# Altium project RNG_RPI.PrjPcb (part 2 of 3)

## Sheet FPGA_config.SchDoc: RNG RPI Interface
size 420 x 297 mm; Author: G.Kasprowicz; CompanyName: WUT ISE; DrawnBy: G.Kasprowicz; Organization: WUT ISE; Address1: PW ISE; Address2: Nowowiejska 15/19 00-665 Warsaw; Address3: gkasprow@gmail.com; Revision: 2; SheetNumber: -; SheetTotal: -; ModifiedBy: -; CheckedDate: -; Title2: FPGA config & RPI; DivGrp: WUT ISE; Designer: G.Kasprowicz; ModifiedDate: -; ProjectName: Sensor Box
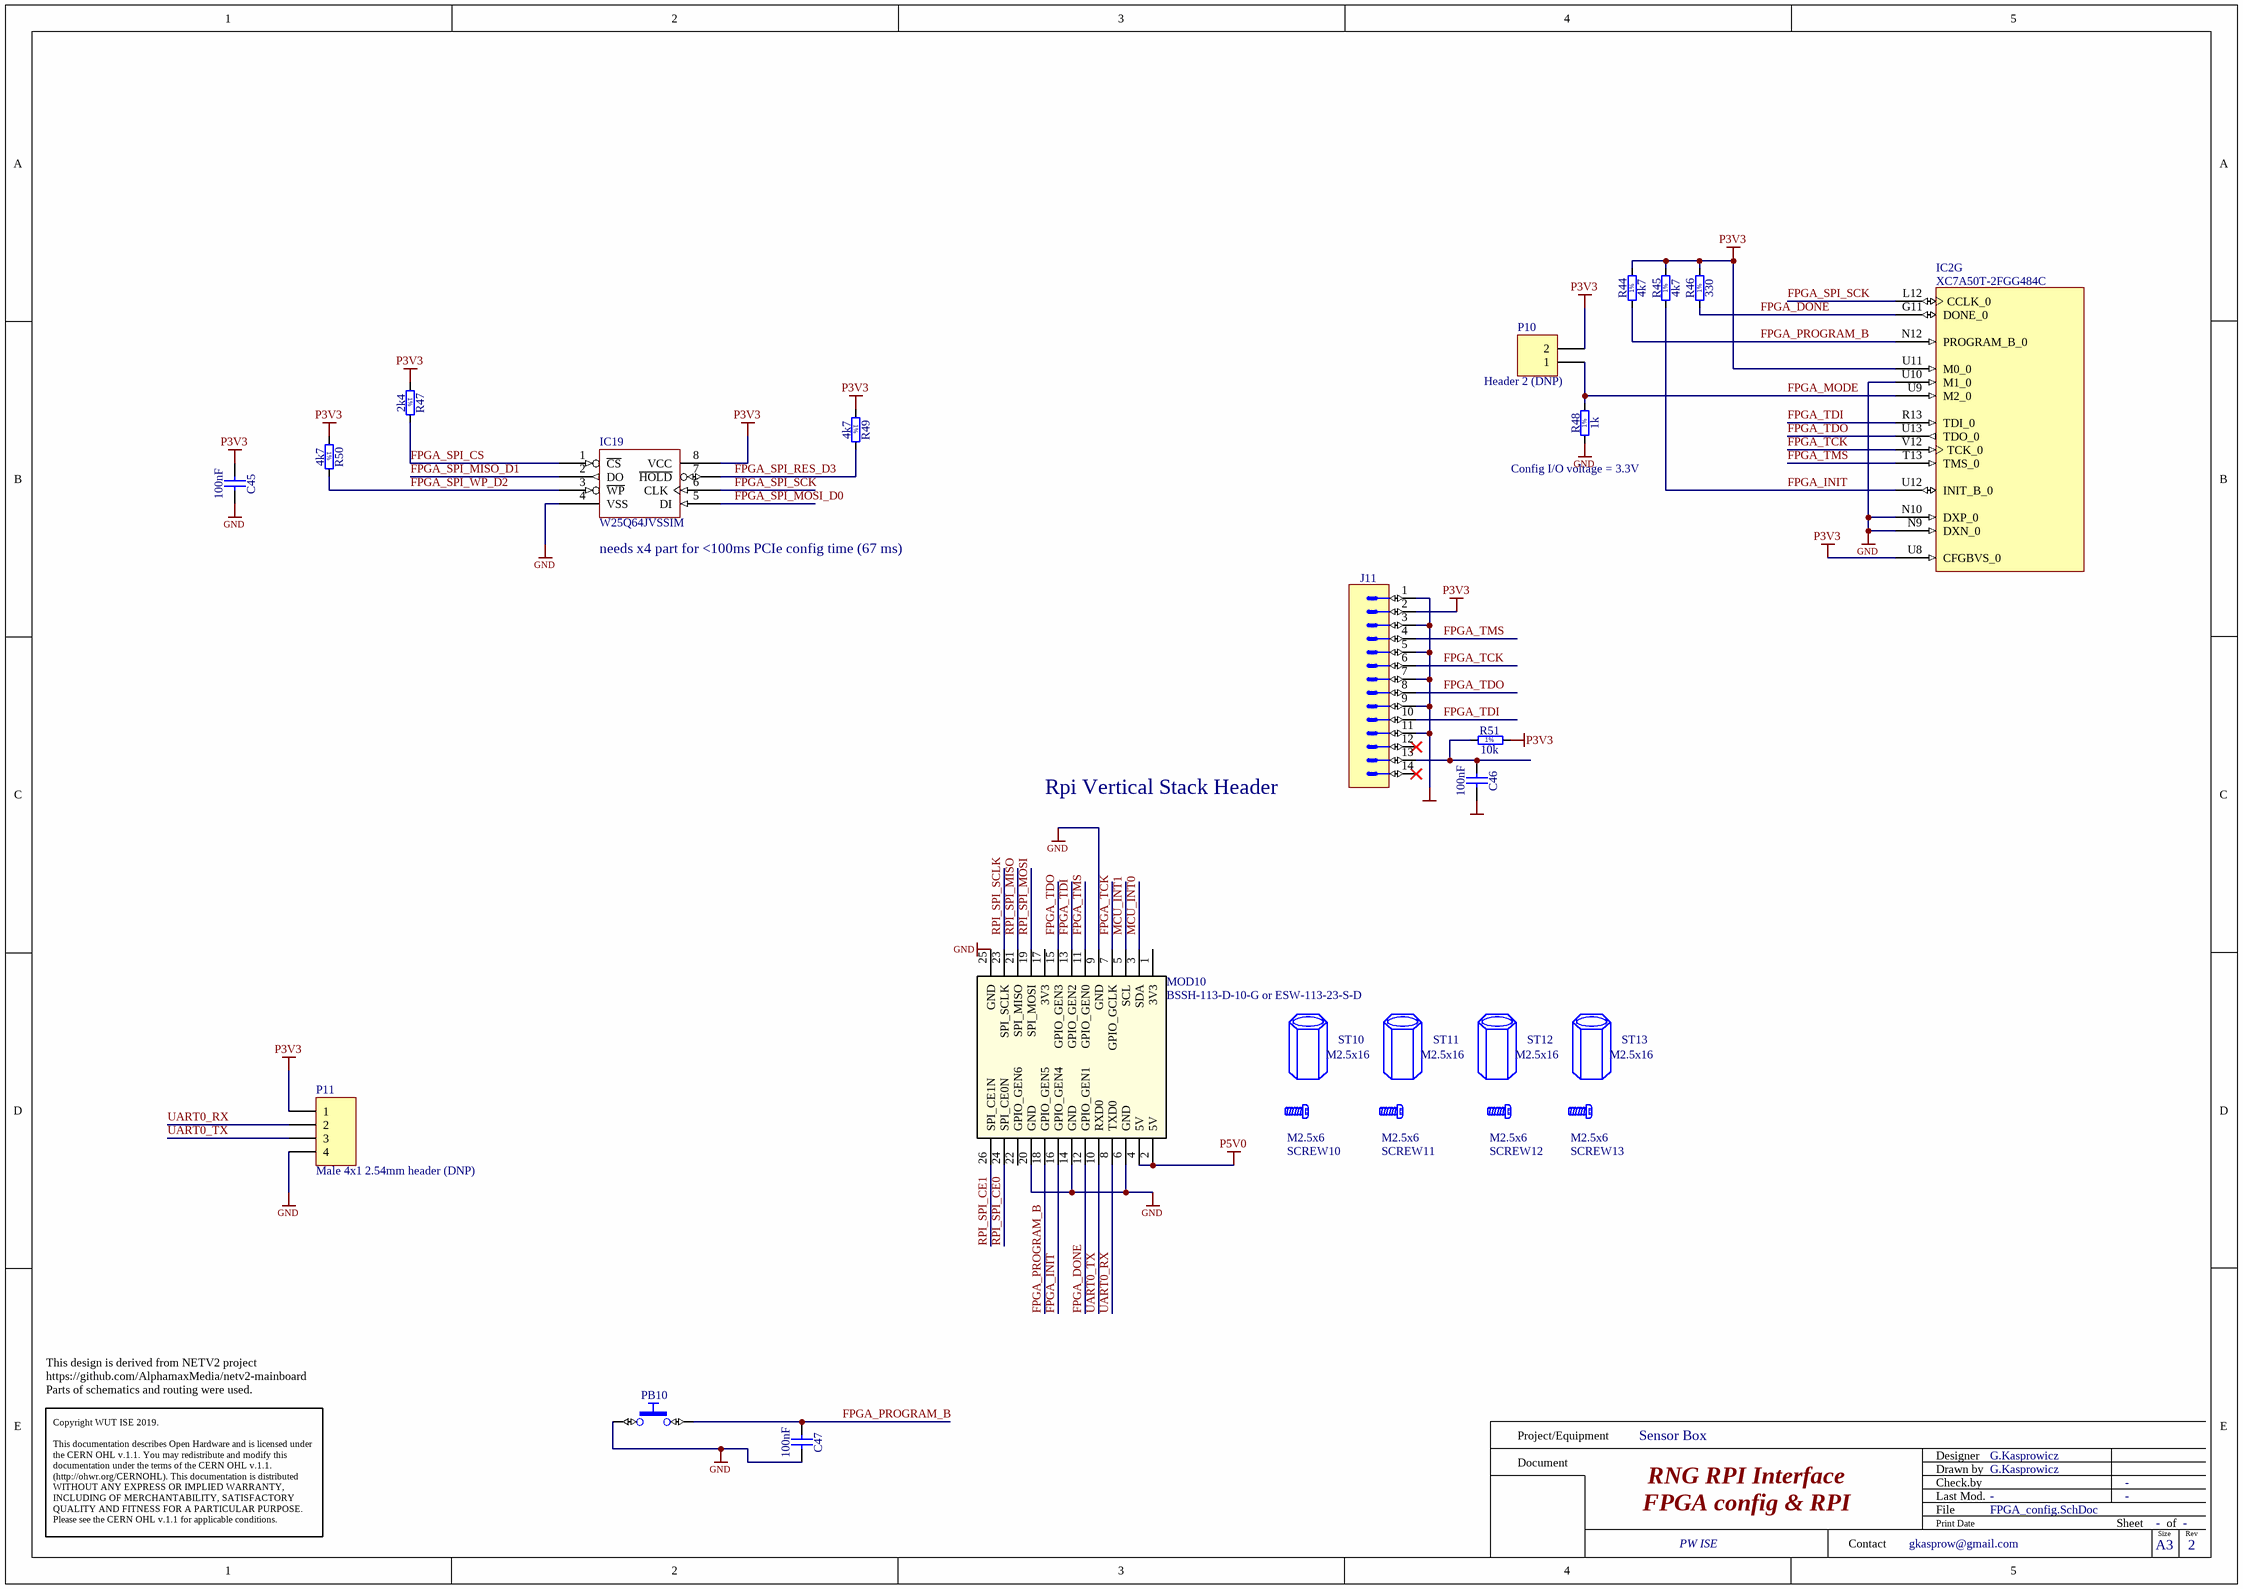
[diagram p1: FPGA_config.SchDoc]

### Parts
C45  100nF  [CAPC0603X33N]
C46  100nF  [CAPC0603X33N]
C47  100nF  [CAPC0603X33N]
IC2  XC7A50T-2FGG484C  [BGA484C100P22X22_2300X2300X260]  (part G of 11)
IC19  W25Q64JVSSIM  [SOIC127P790X216-8N]
J11  Milli-Grid™  [MOLEX_87832-1420]  (value not drawn)
MOD10  BSSH-113-D-10-G or ESW-113-23-S-D  [Raspberr Pi - 26]
P10  Header 2 (DNP)  [HDR1X2]
P11  Male 4x1 2.54mm header (DNP)  [HDR1X4]
PB10  Push Button  [PB_TYCO_FSMSM]  (value not drawn)
R44  4k7  [RESC1005X40N]
R45  4k7  [RESC1005X40N]
R46  330  [RESC1005X40N]
R47  2k4  [RESC1005X40N]
R48  1k  [RESC1005X40N]
R49  4k7  [RESC1005X40N]
R50  4k7  [RESC1005X40N]
R51  10k  [RESC1005X40N]
SCREW10  M2.5x6  [BOSSARD_BN5687-3061597_v]
SCREW11  M2.5x6  [BOSSARD_BN5687-3061597_v]
SCREW12  M2.5x6  [BOSSARD_BN5687-3061597_v]
SCREW13  M2.5x6  [BOSSARD_BN5687-3061597_v]
ST10  M2.5x16  [WURTH_970160155]
ST11  M2.5x16  [WURTH_970160155]
ST12  M2.5x16  [WURTH_970160155]
ST13  M2.5x16  [WURTH_970160155]

### Nets
GND: C45.2 C46.2 C47.2 IC2.N9(DXN_0) IC2.N10(DXP_0) IC2.U10(M1_0) IC19.4(VSS) J11.1 J11.3 J11.5 J11.7 J11.9 J11.11 MOD10.6(GND) MOD10.9(GND) MOD10.14(GND) MOD10.20(GND) MOD10.25(GND) P11.4 PB10.1 R48.1
P3V3: C45.1 IC2.U8(CFGBVS_0) IC2.U11(M0_0) IC19.8(VCC) J11.2 P10.2 P11.1 R44.2 R45.2 R46.2 R47.1 R49.1 R50.1 R51.2
P5V0: MOD10.2(5V) MOD10.4(5V)
FPGA_DONE: IC2.G11(DONE_0) MOD10.12(GPIO_GEN1) R46.1
FPGA_INIT: IC2.U12(INIT_B_0) MOD10.16(GPIO_GEN4) R45.1
FPGA_MODE: IC2.U9(M2_0) P10.1 R48.2
FPGA_PROGRAM_B: C47.1 IC2.N12(PROGRAM_B_0) MOD10.18(GPIO_GEN5) PB10.2 R44.1
FPGA_SPI_CS: IC19.1(~{CS}) R47.2
FPGA_SPI_MISO_D1: IC19.2(DO)
FPGA_SPI_MOSI_D0: IC19.5(DI)
FPGA_SPI_RES_D3: IC19.7(~{HOLD}) R49.2
FPGA_SPI_SCK: IC2.L12(CCLK_0) IC19.6(CLK)
FPGA_SPI_WP_D2: IC19.3(~{WP}) R50.2
FPGA_TCK: IC2.V12(TCK_0) J11.6 MOD10.7(GPIO_GCLK)
FPGA_TDI: IC2.R13(TDI_0) J11.10 MOD10.13(GPIO_GEN2)
FPGA_TDO: IC2.U13(TDO_0) J11.8 MOD10.15(GPIO_GEN3)
FPGA_TMS: IC2.T13(TMS_0) J11.4 MOD10.11(GPIO_GEN0)
MCU_INT0: MOD10.3(SDA)
MCU_INT1: MOD10.5(SCL)
RPI_SPI_CE0: MOD10.24(SPI_CE0N)
RPI_SPI_CE1: MOD10.26(SPI_CE1N)
RPI_SPI_MISO: MOD10.21(SPI_MISO)
RPI_SPI_MOSI: MOD10.19(SPI_MOSI)
RPI_SPI_SCLK: MOD10.23(SPI_SCLK)
UART0_RX: MOD10.8(TXD0) P11.2
UART0_TX: MOD10.10(RXD0) P11.3
NetC46_1: C46.1 J11.13 R51.1

Not connected (* = marked no-connect by the designer): J11 12* 14*; MOD10 1(3V3) 17(3V3) 22(GPIO_GEN6)

### Notes on the sheet
- (near R48) Config I/O voltage = 3.3V
- (near IC19) needs x4 part for <100ms PCIe config time (67 ms)
- Rpi Vertical Stack Header
- This design is derived from NETV2 project
  https://github.com/AlphamaxMedia/netv2-mainboard
  Parts of schematics and routing were used.
- Project/Equipment
- Document
- Designer
- Drawn by
- Check.by
- Copyright WUT ISE 2019.
  This documentation describes Open Hardware and is licensed under the CERN OHL v.1.1. You may redistribute and modify this documentation under the terms of the CERN OHL v.1.1. (http://ohwr.org/CERNOHL). This documentation is distributed WITHOUT ANY EXPRESS OR IMPLIED WARRANTY, INCLUDING OF MERCHANTABILITY, SATISFACTORY QUALITY AND FITNESS FOR A PARTICULAR PURPOSE. Please see the CERN OHL v.1.1 for applicable conditions.
- Contact
- File
- Last Mod.
- Print Date
- Sheet
- Size
- A3
- of
- Rev
- (in symbol R0402_1K_1%_0.0625W_100PPM) 1%
- (in symbol R0402_2K4_1%_0.0625W_100PPM) 1%
- (in symbol R0402_4K7_1%_0.0625W_100PPM) 1%
- (in symbol R0402_10K_1%_0.0625W_100PPM) 1%
- (in symbol R0402_330R_1%_0.0625W_100PPM) 1%

### Library data of the parts
C45-C47 = CC0201_100NF_6.3V_10%_X5R: Non-polarised capacitor; Part Description: SMD Multilayer Chip Ceramic Capacitor; Manufacturer: GENERIC; Manufacturer1 Part Number: 02016D104KAT2A; Voltage: 6.3V; TC: X5R; Tolerance: ±10%; Part Number: CC0201_100NF_6.3V_10%_X5R; Component Kind: Standard; Component Type: Standard; Pin Count: 2; Value: 100nF; Status: Not Recommended; Manufacturer Part Number: CC0201_100NF_6.3V_10%_X5R; Case: 0201; Mounted: Yes; Socket: No; SMD: Yes; Sense: No; Manufacturer1 Example: AVX; Manufacturer1 ComponentHeight: 0.33mm; HelpURL: \\cern.ch\dfs\Applications\Altium\Datasheets\CC0201_X5R_AVX.pdf; Author: CERN DEM JLC; CreateDate: 03.12.2007; LatestRevisionDate: 03.12.2007
IC2 = XC7A50T-2FGG484C: Artix-7 FPGA, 4 GTPs, 250 User I/Os, 484-Ball Fine-Pitch Thin BGA (1.0mm Pitch), Speed Grade 2, Commercial Grade, Pb-Free; Manufacturer: XILINX; PressFit: No; Bonding: No; Part Number: XC7A50T-2FGG484C; Component Kind: Standard; Component Type: Standard; Device: XC7A50T-2FGG484C; PackageDescription: BGA, 1.00mm Pitch, Square; 484 Pin, 22 Columns x 22 Rows, Body 23mm X 23mm X 2.60mm H, IPC Medium Density; Part Description: Artix-7 FPGA, 4 GTPs, 250 User I/Os, 484-Ball Fine-Pitch Thin BGA (1.0mm Pitch), Speed Grade 2, Commercial Grade, Pb-Free; Manufacturer Part Number: XC7A50T-2FGG484C; Pin Count: 484; Case: BGA484; Mounted: Yes; Socket: No; SMD: Yes; Sense: No; ComponentHeight: 2.6mm; HelpURL: \\cern.ch\dfs\Applications\Altium\Datasheets\XC7A50T-2FGG484C.pdf; ComponentLink1URL: \\cern.ch\dfs\Applications\Altium\Datasheets\XC7A50T-2FGG484C_Package-Pinout.pdf; ComponentLink1Description: Package/Pinout; Author: CERN DEM JMW; CreateDate: 26.07.2018; LatestRevisionDate: 26.07.2018
IC19 = EN25P05-50GCP: 64Mbit SPI NOR FLASH; MYPN: UW25Q64JVSSIM; VENDOR: Winbond; MPN: W25Q64JVSSIM
J11 = MOLEX_87832-1420: Connector 14 Male; Part Description: 2.00mm (.079") Pitch Milli-Grid™ Header, Surface Mount, Vertical, Shrouded, 14 Circuits,with Locking Windows and Centre Polarization Slot, PCB Locator; Manufacturer: MOLEX; PressFit: No; Part Number: MOLEX_87832-1420; Component Kind: Standard; Component Type: Standard; Pin Count: 14; Family: Milli-Grid™; Mounted: Yes; Socket: No; SMD: Yes; Sense: No; Status: None; Manufacturer Part Number: 87832-1420; ComponentHeight: 7.6mm; HelpURL: \\cern.ch\dfs\Applications\Altium\Datasheets\MOLEX_87832-1420.pdf; Author: CERN DEM JLC; CreateDate: 09.09.2008; LatestRevisionDate: 09.09.2008
MOD10 = Raspberry Pi - 26: Manufacturer: Major League Electroncis; Datasheet: http://s3.amazonaws.com/mlkelly/productMedia/BSSH-1/BSSH-1-D-Datasheet.pdf; Price1: 1.95; Value: BSSH-113-D-10-G or ESW-113-23-S-D; Supplier 1: https://www.adafruit.com/product/1112; Supplier Part Number 1: BSSH-113-D-10-G or ESW-113-23-S-D; Manufacturer Part Number: BSSH-113-D-10-G or ESW-113-23-S-D
P10 = Header 2: Header, 2-Pin; LatestRevisionDate: 17-Jul-2002; LatestRevisionNote: Re-released for DXP Platform.; Publisher: Altium Limited; VENDOR: DNP; MPN: DNP; MYPN: DNP
P11 = Header 4: Header, 4-Pin; MYPN: J-HDR-2.54-4x1-STD-DNP; LatestRevisionDate: 17-Jul-2002; LatestRevisionNote: Re-released for DXP Platform.; Publisher: Altium Limited; MPN: DNP; VENDOR: DNP
PB10 = PB_TYCO_FSMSM: Push-Button Switch SPDT; Part Description: 12VDC 50mA SPST Tactile  Push-Button Switch; Manufacturer: TYCO ELECTRONICS; Manufacturer Part Number: FSMSM or 1437566-3; PressFit: No; Part Number: PB_TYCO_FSMSM; Component Kind: Standard; Component Type: Standard; Pin Count: 2; PackageDescription: Body 3.5x6.0mm, Pushbutton Switch,  TYCO ALCOSWITCH FSMSM Serie; Family: Push Button; Mounted: Yes; Socket: No; SMD: Yes; Sense: No; Status: None; ComponentHeight: 4.3mm; HelpURL: \\cern.ch\dfs\Applications\Altium\Datasheets\PB_TYCO_FSMSM.pdf; Author: CERN DEM JLC; CreateDate: 30.06.2008; LatestRevisionDate: 21.06.2012
R44 R45 R49 R50 = R0402_4K7_1%_0.0625W_100PPM: Resistor - 1%; Part Description: General Purpose Thick Film Chip Resistor; Manufacturer: GENERIC; Manufacturer1 Part Number: 232270674702L; TC: ±100ppm/°C; PressFit: No; Part Number: R0402_4K7_1%_0.0625W_100PPM; Component Kind: Standard; Component Type: Standard; Pin Count: 2; Value: 4k7; Status: Not Recommended; Power: 0.0625W; Tolerance: ±1%; Manufacturer Part Number: R0402_4K7_1%_0.0625W_100PPM; Case: 0402; Mounted: Yes; Sense: No; Socket: No; SMD: Yes; Manufacturer1 Example: YAGEO PHYCOMP; Manufacturer1 ComponentHeight: 0.4mm; HelpURL: \\cern.ch\dfs\Applications\Altium\Datasheets\R0402_Phycomp_RC0402.pdf; Author: CERN DEM JLC; CreateDate: 03.12.2007; LatestRevisionDate: 17.10.2012
R46 = R0402_330R_1%_0.0625W_100PPM: Resistor - 1%; Part Description: General Purpose Thick Film Chip Resistor; Manufacturer: GENERIC; Manufacturer1 Part Number: 232270673301L; TC: ±100ppm/°C; PressFit: No; Part Number: R0402_330R_1%_0.0625W_100PPM; Component Kind: Standard; Component Type: Standard; Pin Count: 2; Value: 330; Status: Not Recommended; Power: 0.0625W; Tolerance: ±1%; Manufacturer Part Number: R0402_330R_1%_0.0625W_100PPM; Case: 0402; Mounted: Yes; Sense: No; Socket: No; SMD: Yes; Manufacturer1 Example: YAGEO PHYCOMP; Manufacturer1 ComponentHeight: 0.4mm; HelpURL: \\cern.ch\dfs\Applications\Altium\Datasheets\R0402_Phycomp_RC0402.pdf; Author: CERN DEM JLC; CreateDate: 03.12.2007; LatestRevisionDate: 17.10.2012
R47 = R0402_2K4_1%_0.0625W_100PPM: Resistor - 1%; Part Description: General Purpose Thick Film Chip Resistor; Manufacturer: GENERIC; Manufacturer1 Part Number: 232270672402L; TC: ±100ppm/°C; PressFit: No; Part Number: R0402_2K4_1%_0.0625W_100PPM; Component Kind: Standard; Component Type: Standard; Pin Count: 2; Value: 2k4; Status: Not Recommended; Power: 0.0625W; Tolerance: ±1%; Manufacturer Part Number: R0402_2K4_1%_0.0625W_100PPM; Case: 0402; Mounted: Yes; Sense: No; Socket: No; SMD: Yes; Manufacturer1 Example: YAGEO PHYCOMP; Manufacturer1 ComponentHeight: 0.4mm; HelpURL: \\cern.ch\dfs\Applications\Altium\Datasheets\R0402_Phycomp_RC0402.pdf; Author: CERN DEM JLC; CreateDate: 03.12.2007; LatestRevisionDate: 17.10.2012
R48 = R0402_1K_1%_0.0625W_100PPM: Resistor - 1%; Part Description: General Purpose Thick Film Chip Resistor; Manufacturer: GENERIC; Manufacturer1 Part Number: 232270671002L; TC: ±100ppm/°C; PressFit: No; Part Number: R0402_1K_1%_0.0625W_100PPM; Component Kind: Standard; Component Type: Standard; Pin Count: 2; Value: 1k; Status: Not Recommended; Power: 0.0625W; Tolerance: ±1%; Manufacturer Part Number: R0402_1K_1%_0.0625W_100PPM; Case: 0402; Mounted: Yes; Sense: No; Socket: No; SMD: Yes; Manufacturer1 Example: YAGEO PHYCOMP; Manufacturer1 ComponentHeight: 0.4mm; HelpURL: \\cern.ch\dfs\Applications\Altium\Datasheets\R0402_Phycomp_RC0402.pdf; Author: CERN DEM JLC; CreateDate: 03.12.2007; LatestRevisionDate: 17.10.2012
R51 = R0402_10K_1%_0.0625W_100PPM: Resistor - 1%; Part Description: General Purpose Thick Film Chip Resistor; Manufacturer: GENERIC; Manufacturer1 Part Number: 232270671003L; TC: ±100ppm/°C; PressFit: No; Part Number: R0402_10K_1%_0.0625W_100PPM; Component Kind: Standard; Component Type: Standard; Pin Count: 2; Value: 10k; Status: Not Recommended; Power: 0.0625W; Tolerance: ±1%; Manufacturer Part Number: R0402_10K_1%_0.0625W_100PPM; Case: 0402; Mounted: Yes; Sense: No; Socket: No; SMD: Yes; Manufacturer1 Example: YAGEO PHYCOMP; Manufacturer1 ComponentHeight: 0.4mm; HelpURL: \\cern.ch\dfs\Applications\Altium\Datasheets\R0402_Phycomp_RC0402.pdf; Author: CERN DEM JLC; CreateDate: 03.12.2007; LatestRevisionDate: 17.10.2012; ClassName: FPGA_JTAG
SCREW10-SCREW13 = BOSSARD_BN5687-3061597_v: Screw; Part Description: M2.5 L=6mm Hexalobular Socket Pan Head Screw, Fully Threaded, Stainless Steel A2; Manufacturer Part Number: BN5687 Art.3061597; PressFit: No; Part Number: BOSSARD_BN5687-3061597_v; Component Kind: Standard; Component Type: Mechanical; Pin Count: 0; PackageDescription: M2.5 L=6mm Hexalobular Socket Pan Head Screw, Fully Threaded - Stainless Steel A2; Mounted: Yes; Socket: No; SMD: No; Sense: No; Status: None; Value: M2.5x6; Manufacturer: BOSSARD; ComponentHeight: 2.1mm; HelpURL: \\cern.ch\dfs\Applications\Altium\Datasheets\BOSSARD_BN5687-3061597.pdf; Author: CERN DEM JLC; CreateDate: 30.05.2013; LatestRevisionDate: 30.05.2013
ST10-ST13 = MECH_Standoff_M2.5x16: M2.5x16 plastic standoff; Part Description: M2.5x16 female Hex Spacer made of plastic; Manufacturer: WURTH; Manufacturer Part Number: 970160155; PressFit: No; Part Number: WURTH_970160155; Component Kind: Standard; Component Type: Mechanical; Pin Count: 0; PackageDescription: M2.5 L=16mm Hexalobular Socket Pan Head Screw, Fully Threaded - plastic; Mounted: Yes; Socket: No; SMD: No; Sense: No; Status: None; Value: M2.5x16; ComponentHeight: 16mm; HelpURL: \\cern.ch\dfs\Applications\Altium\Datasheets\BOSSARD_BN5687-3061597.pdf; Author: GK; CreateDate: 25.02.2019; LatestRevisionDate: 25.02.2019

## Sheet FPGA.SchDoc: RNG RPI Interface
size 420 x 297 mm; Author: G.Kasprowicz; CompanyName: WUT ISE; DrawnBy: G.Kasprowicz; Organization: WUT ISE; Address1: PW ISE; Address2: Nowowiejska 15/19 00-665 Warsaw; Address3: gkasprow@gmail.com; Revision: 2; SheetNumber: -; SheetTotal: -; ModifiedBy: -; CheckedDate: -; Title2: FPGA banks; DivGrp: WUT ISE; Designer: G.Kasprowicz; ModifiedDate: -; ProjectName: Sensor Box
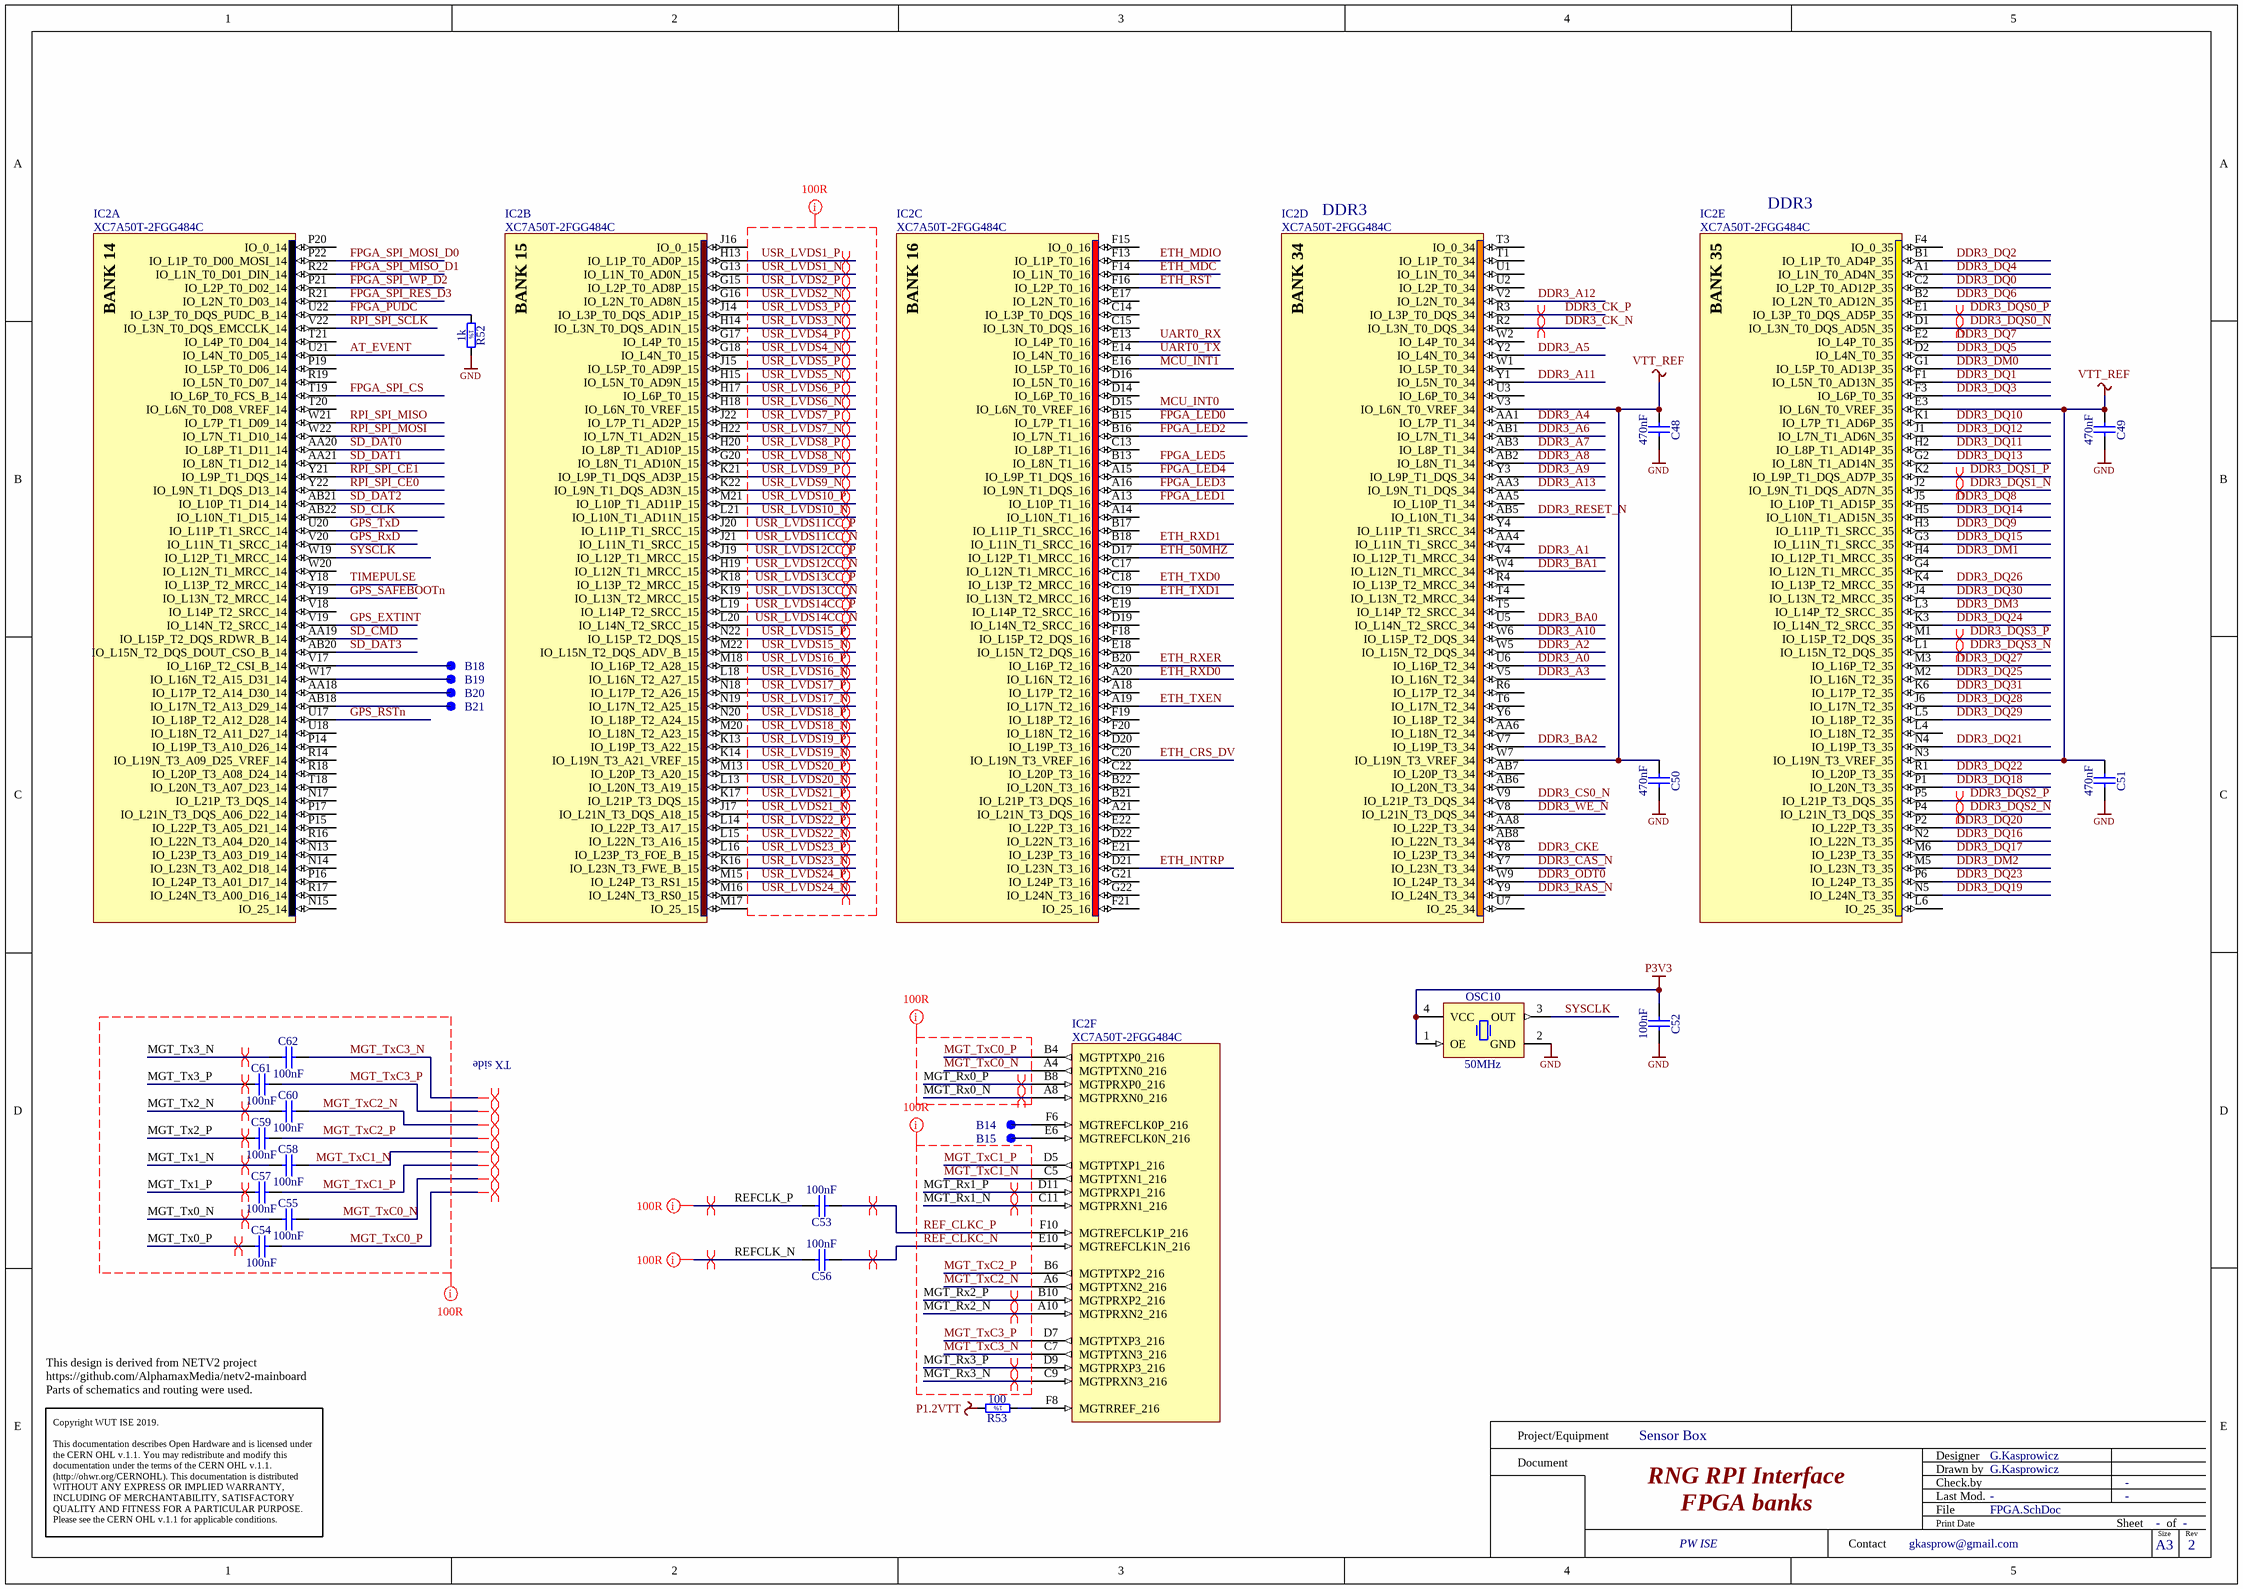
[diagram p2: FPGA.SchDoc]

### Parts
B14  SMD Pad  [C100]  (value not drawn)
B15  SMD Pad  [C100]  (value not drawn)
B18  SMD Pad  [C100]  (value not drawn)
B19  SMD Pad  [C100]  (value not drawn)
B20  SMD Pad  [C100]  (value not drawn)
B21  SMD Pad  [C100]  (value not drawn)
C48  470nF  [CAPC0603X33N]
C49  470nF  [CAPC0603X33N]
C50  470nF  [CAPC0603X33N]
C51  470nF  [CAPC0603X33N]
C52  100nF  [CAPC0603X33N]
C53  100nF  [CAPC0603X33N]
C54  100nF  [CAPC0603X33N]
C55  100nF  [CAPC0603X33N]
C56  100nF  [CAPC0603X33N]
C57  100nF  [CAPC0603X33N]
C58  100nF  [CAPC0603X33N]
C59  100nF  [CAPC0603X33N]
C60  100nF  [CAPC0603X33N]
C61  100nF  [CAPC0603X33N]
C62  100nF  [CAPC0603X33N]
IC2  XC7A50T-2FGG484C  [BGA484C100P22X22_2300X2300X260]  (parts A,B,C,D,E,F of 11)
OSC10  50MHz  [OSCSC254P320X500X130-4N]
R52  1k  [RESC1005X40N]
R53  100  [RESC1005X40N]

### Nets
GND: C48.2 C49.2 C50.2 C51.2 C52.2 OSC10.2(GND) R52.2
P1.2VTT: R53.2
P3V3: C52.1 OSC10.1(OE) OSC10.4(VCC)
VTT_REF: C48.1 C49.1 C50.1 C51.1 IC2.E3(IO_L6N_T0_VREF_35) IC2.N3(IO_L19N_T3_VREF_35) IC2.V3(IO_L6N_T0_VREF_34) IC2.W7(IO_L19N_T3_VREF_34)
AT_EVENT: IC2.U21(IO_L4N_T0_D05_14)
DDR3_A0: IC2.U6(IO_L16P_T2_34)
DDR3_A1: IC2.V4(IO_L12P_T1_MRCC_34)
DDR3_A2: IC2.W5(IO_L15N_T2_DQS_34)
DDR3_A3: IC2.V5(IO_L16N_T2_34)
DDR3_A4: IC2.AA1(IO_L7P_T1_34)
DDR3_A5: IC2.Y2(IO_L4N_T0_34)
DDR3_A6: IC2.AB1(IO_L7N_T1_34)
DDR3_A7: IC2.AB3(IO_L8P_T1_34)
DDR3_A8: IC2.AB2(IO_L8N_T1_34)
DDR3_A9: IC2.Y3(IO_L9P_T1_DQS_34)
DDR3_A10: IC2.W6(IO_L15P_T2_DQS_34)
DDR3_A11: IC2.Y1(IO_L5N_T0_34)
DDR3_A12: IC2.V2(IO_L2N_T0_34)
DDR3_A13: IC2.AA3(IO_L9N_T1_DQS_34)
DDR3_BA0: IC2.U5(IO_L14N_T2_SRCC_34)
DDR3_BA1: IC2.W4(IO_L12N_T1_MRCC_34)
DDR3_BA2: IC2.V7(IO_L19P_T3_34)
DDR3_CAS_N: IC2.Y7(IO_L23N_T3_34)
DDR3_CK_N: IC2.R2(IO_L3N_T0_DQS_34)
DDR3_CK_P: IC2.R3(IO_L3P_T0_DQS_34)
DDR3_CKE: IC2.Y8(IO_L23P_T3_34)
DDR3_CS0_N: IC2.V9(IO_L21P_T3_DQS_34)
DDR3_DM0: IC2.G1(IO_L5P_T0_AD13P_35)
DDR3_DM1: IC2.H4(IO_L12P_T1_MRCC_35)
DDR3_DM2: IC2.M5(IO_L23N_T3_35)
DDR3_DM3: IC2.L3(IO_L14P_T2_SRCC_35)
DDR3_DQ0: IC2.C2(IO_L2P_T0_AD12P_35)
DDR3_DQ1: IC2.F1(IO_L5N_T0_AD13N_35)
DDR3_DQ2: IC2.B1(IO_L1P_T0_AD4P_35)
DDR3_DQ3: IC2.F3(IO_L6P_T0_35)
DDR3_DQ4: IC2.A1(IO_L1N_T0_AD4N_35)
DDR3_DQ5: IC2.D2(IO_L4N_T0_35)
DDR3_DQ6: IC2.B2(IO_L2N_T0_AD12N_35)
DDR3_DQ7: IC2.E2(IO_L4P_T0_35)
DDR3_DQ8: IC2.J5(IO_L10P_T1_AD15P_35)
DDR3_DQ9: IC2.H3(IO_L11P_T1_SRCC_35)
DDR3_DQ10: IC2.K1(IO_L7P_T1_AD6P_35)
DDR3_DQ11: IC2.H2(IO_L8P_T1_AD14P_35)
DDR3_DQ12: IC2.J1(IO_L7N_T1_AD6N_35)
DDR3_DQ13: IC2.G2(IO_L8N_T1_AD14N_35)
DDR3_DQ14: IC2.H5(IO_L10N_T1_AD15N_35)
DDR3_DQ15: IC2.G3(IO_L11N_T1_SRCC_35)
DDR3_DQ16: IC2.N2(IO_L22N_T3_35)
DDR3_DQ17: IC2.M6(IO_L23P_T3_35)
DDR3_DQ18: IC2.P1(IO_L20N_T3_35)
DDR3_DQ19: IC2.N5(IO_L24N_T3_35)
DDR3_DQ20: IC2.P2(IO_L22P_T3_35)
DDR3_DQ21: IC2.N4(IO_L19P_T3_35)
DDR3_DQ22: IC2.R1(IO_L20P_T3_35)
DDR3_DQ23: IC2.P6(IO_L24P_T3_35)
DDR3_DQ24: IC2.K3(IO_L14N_T2_SRCC_35)
DDR3_DQ25: IC2.M2(IO_L16N_T2_35)
DDR3_DQ26: IC2.K4(IO_L13P_T2_MRCC_35)
DDR3_DQ27: IC2.M3(IO_L16P_T2_35)
DDR3_DQ28: IC2.J6(IO_L17N_T2_35)
DDR3_DQ29: IC2.L5(IO_L18P_T2_35)
DDR3_DQ30: IC2.J4(IO_L13N_T2_MRCC_35)
DDR3_DQ31: IC2.K6(IO_L17P_T2_35)
DDR3_DQS0_N: IC2.D1(IO_L3N_T0_DQS_AD5N_35)
DDR3_DQS0_P: IC2.E1(IO_L3P_T0_DQS_AD5P_35)
DDR3_DQS1_N: IC2.J2(IO_L9N_T1_DQS_AD7N_35)
DDR3_DQS1_P: IC2.K2(IO_L9P_T1_DQS_AD7P_35)
DDR3_DQS2_N: IC2.P4(IO_L21N_T3_DQS_35)
DDR3_DQS2_P: IC2.P5(IO_L21P_T3_DQS_35)
DDR3_DQS3_N: IC2.L1(IO_L15N_T2_DQS_35)
DDR3_DQS3_P: IC2.M1(IO_L15P_T2_DQS_35)
DDR3_ODT0: IC2.W9(IO_L24P_T3_34)
DDR3_RAS_N: IC2.Y9(IO_L24N_T3_34)
DDR3_RESET_N: IC2.AB5(IO_L10N_T1_34)
DDR3_WE_N: IC2.V8(IO_L21N_T3_DQS_34)
ETH_50MHZ: IC2.D17(IO_L12P_T1_MRCC_16)
ETH_CRS_DV: IC2.C20(IO_L19N_T3_VREF_16)
ETH_INTRP: IC2.D21(IO_L23N_T3_16)
ETH_MDC: IC2.F14(IO_L1N_T0_16)
ETH_MDIO: IC2.F13(IO_L1P_T0_16)
ETH_RST: IC2.F16(IO_L2P_T0_16)
ETH_RXD0: IC2.A20(IO_L16N_T2_16)
ETH_RXD1: IC2.B18(IO_L11N_T1_SRCC_16)
ETH_RXER: IC2.B20(IO_L16P_T2_16)
ETH_TXD0: IC2.C18(IO_L13P_T2_MRCC_16)
ETH_TXD1: IC2.C19(IO_L13N_T2_MRCC_16)
ETH_TXEN: IC2.A19(IO_L17N_T2_16)
FPGA_LED0: IC2.B15(IO_L7P_T1_16)
FPGA_LED1: IC2.A13(IO_L10P_T1_16)
FPGA_LED2: IC2.B16(IO_L7N_T1_16)
FPGA_LED3: IC2.A16(IO_L9N_T1_DQS_16)
FPGA_LED4: IC2.A15(IO_L9P_T1_DQS_16)
FPGA_LED5: IC2.B13(IO_L8N_T1_16)
FPGA_PUDC: IC2.U22(IO_L3P_T0_DQS_PUDC_B_14) R52.1
FPGA_SPI_CS: IC2.T19(IO_L6P_T0_FCS_B_14)
FPGA_SPI_MISO_D1: IC2.R22(IO_L1N_T0_D01_DIN_14)
FPGA_SPI_MOSI_D0: IC2.P22(IO_L1P_T0_D00_MOSI_14)
FPGA_SPI_RES_D3: IC2.R21(IO_L2N_T0_D03_14)
FPGA_SPI_WP_D2: IC2.P21(IO_L2P_T0_D02_14)
GPS_EXTINT: IC2.V19(IO_L14N_T2_SRCC_14)
GPS_RSTn: IC2.U17(IO_L18P_T2_A12_D28_14)
GPS_RxD: IC2.V20(IO_L11N_T1_SRCC_14)
GPS_SAFEBOOTn: IC2.Y19(IO_L13N_T2_MRCC_14)
GPS_TxD: IC2.U20(IO_L11P_T1_SRCC_14)
MCU_INT0: IC2.D15(IO_L6N_T0_VREF_16)
MCU_INT1: IC2.E16(IO_L5P_T0_16)
MGT_Rx0_N: IC2.A8(MGTPRXN0_216)
MGT_Rx0_P: IC2.B8(MGTPRXP0_216)
MGT_Rx1_N: IC2.C11(MGTPRXN1_216)
MGT_Rx1_P: IC2.D11(MGTPRXP1_216)
MGT_Rx2_N: IC2.A10(MGTPRXN2_216)
MGT_Rx2_P: IC2.B10(MGTPRXP2_216)
MGT_Rx3_N: IC2.C9(MGTPRXN3_216)
MGT_Rx3_P: IC2.D9(MGTPRXP3_216)
MGT_Tx0_N: C55.1
MGT_Tx0_P: C54.1
MGT_Tx1_N: C58.1
MGT_Tx1_P: C57.1
MGT_Tx2_N: C60.1
MGT_Tx2_P: C59.1
MGT_Tx3_N: C62.1
MGT_Tx3_P: C61.1
MGT_TxC0_N: C55.2 IC2.A4(MGTPTXN0_216)
MGT_TxC0_P: C54.2 IC2.B4(MGTPTXP0_216)
MGT_TxC1_N: C58.2 IC2.C5(MGTPTXN1_216)
MGT_TxC1_P: C57.2 IC2.D5(MGTPTXP1_216)
MGT_TxC2_N: C60.2 IC2.A6(MGTPTXN2_216)
MGT_TxC2_P: C59.2 IC2.B6(MGTPTXP2_216)
MGT_TxC3_N: C62.2 IC2.C7(MGTPTXN3_216)
MGT_TxC3_P: C61.2 IC2.D7(MGTPTXP3_216)
REF_CLKC_N: C56.1 IC2.E10(MGTREFCLK1N_216)
REF_CLKC_P: C53.1 IC2.F10(MGTREFCLK1P_216)
REFCLK_N: C56.2
REFCLK_P: C53.2
RPI_SPI_CE0: IC2.Y22(IO_L9N_T1_DQS_D13_14)
RPI_SPI_CE1: IC2.Y21(IO_L9P_T1_DQS_14)
RPI_SPI_MISO: IC2.W21(IO_L7P_T1_D09_14)
RPI_SPI_MOSI: IC2.W22(IO_L7N_T1_D10_14)
RPI_SPI_SCLK: IC2.V22(IO_L3N_T0_DQS_EMCCLK_14)
SD_CLK: IC2.AB22(IO_L10N_T1_D15_14)
SD_CMD: IC2.AA19(IO_L15P_T2_DQS_RDWR_B_14)
SD_DAT0: IC2.AA20(IO_L8P_T1_D11_14)
SD_DAT1: IC2.AA21(IO_L8N_T1_D12_14)
SD_DAT2: IC2.AB21(IO_L10P_T1_D14_14)
SD_DAT3: IC2.AB20(IO_L15N_T2_DQS_DOUT_CSO_B_14)
SYSCLK: IC2.W19(IO_L12P_T1_MRCC_14) OSC10.3(OUT)
TIMEPULSE: IC2.Y18(IO_L13P_T2_MRCC_14)
UART0_RX: IC2.E13(IO_L4P_T0_16)
UART0_TX: IC2.E14(IO_L4N_T0_16)
USR_LVDS1_N: IC2.G13(IO_L1N_T0_AD0N_15)
USR_LVDS1_P: IC2.H13(IO_L1P_T0_AD0P_15)
USR_LVDS2_N: IC2.G16(IO_L2N_T0_AD8N_15)
USR_LVDS2_P: IC2.G15(IO_L2P_T0_AD8P_15)
USR_LVDS3_N: IC2.H14(IO_L3N_T0_DQS_AD1N_15)
USR_LVDS3_P: IC2.J14(IO_L3P_T0_DQS_AD1P_15)
USR_LVDS4_N: IC2.G18(IO_L4N_T0_15)
USR_LVDS4_P: IC2.G17(IO_L4P_T0_15)
USR_LVDS5_N: IC2.H15(IO_L5N_T0_AD9N_15)
USR_LVDS5_P: IC2.J15(IO_L5P_T0_AD9P_15)
USR_LVDS6_N: IC2.H18(IO_L6N_T0_VREF_15)
USR_LVDS6_P: IC2.H17(IO_L6P_T0_15)
USR_LVDS7_N: IC2.H22(IO_L7N_T1_AD2N_15)
USR_LVDS7_P: IC2.J22(IO_L7P_T1_AD2P_15)
USR_LVDS8_N: IC2.G20(IO_L8N_T1_AD10N_15)
USR_LVDS8_P: IC2.H20(IO_L8P_T1_AD10P_15)
USR_LVDS9_N: IC2.K22(IO_L9N_T1_DQS_AD3N_15)
USR_LVDS9_P: IC2.K21(IO_L9P_T1_DQS_AD3P_15)
USR_LVDS10_N: IC2.L21(IO_L10N_T1_AD11N_15)
USR_LVDS10_P: IC2.M21(IO_L10P_T1_AD11P_15)
USR_LVDS11CC_N: IC2.J21(IO_L11N_T1_SRCC_15)
USR_LVDS11CC_P: IC2.J20(IO_L11P_T1_SRCC_15)
USR_LVDS12CC_N: IC2.H19(IO_L12N_T1_MRCC_15)
USR_LVDS12CC_P: IC2.J19(IO_L12P_T1_MRCC_15)
USR_LVDS13CC_N: IC2.K19(IO_L13N_T2_MRCC_15)
USR_LVDS13CC_P: IC2.K18(IO_L13P_T2_MRCC_15)
USR_LVDS14CC_N: IC2.L20(IO_L14N_T2_SRCC_15)
USR_LVDS14CC_P: IC2.L19(IO_L14P_T2_SRCC_15)
USR_LVDS15_N: IC2.M22(IO_L15N_T2_DQS_ADV_B_15)
USR_LVDS15_P: IC2.N22(IO_L15P_T2_DQS_15)
USR_LVDS16_N: IC2.L18(IO_L16N_T2_A27_15)
USR_LVDS16_P: IC2.M18(IO_L16P_T2_A28_15)
USR_LVDS17_N: IC2.N19(IO_L17N_T2_A25_15)
USR_LVDS17_P: IC2.N18(IO_L17P_T2_A26_15)
USR_LVDS18_N: IC2.M20(IO_L18N_T2_A23_15)
USR_LVDS18_P: IC2.N20(IO_L18P_T2_A24_15)
USR_LVDS19_N: IC2.K14(IO_L19N_T3_A21_VREF_15)
USR_LVDS19_P: IC2.K13(IO_L19P_T3_A22_15)
USR_LVDS20_N: IC2.L13(IO_L20N_T3_A19_15)
USR_LVDS20_P: IC2.M13(IO_L20P_T3_A20_15)
USR_LVDS21_N: IC2.J17(IO_L21N_T3_DQS_A18_15)
USR_LVDS21_P: IC2.K17(IO_L21P_T3_DQS_15)
USR_LVDS22_N: IC2.L15(IO_L22N_T3_A16_15)
USR_LVDS22_P: IC2.L14(IO_L22P_T3_A17_15)
USR_LVDS23_N: IC2.K16(IO_L23N_T3_FWE_B_15)
USR_LVDS23_P: IC2.L16(IO_L23P_T3_FOE_B_15)
USR_LVDS24_N: IC2.M16(IO_L24N_T3_RS0_15)
USR_LVDS24_P: IC2.M15(IO_L24P_T3_RS1_15)
NetB14_1: B14.1 IC2.F6(MGTREFCLK0P_216)
NetB15_1: B15.1 IC2.E6(MGTREFCLK0N_216)
NetB18_1: B18.1 IC2.V17(IO_L16P_T2_CSI_B_14)
NetB19_1: B19.1 IC2.W17(IO_L16N_T2_A15_D31_14)
NetB20_1: B20.1 IC2.AA18(IO_L17P_T2_A14_D30_14)
NetB21_1: B21.1 IC2.AB18(IO_L17N_T2_A13_D29_14)
NetIC2_F8: IC2.F8(MGTRREF_216) R53.1

Not connected (* = marked no-connect by the designer): IC2 A14(IO_L10N_T1_16) A18(IO_L17P_T2_16) A21(IO_L21N_T3_DQS_16) AA4(IO_L11N_T1_SRCC_34) AA5(IO_L10P_T1_34) AA6(IO_L18N_T2_34) AA8(IO_L22P_T3_34) AB6(IO_L20N_T3_34) AB7(IO_L20P_T3_34) AB8(IO_L22N_T3_34) B17(IO_L11P_T1_SRCC_16) B21(IO_L21P_T3_DQS_16) B22(IO_L20N_T3_16) C13(IO_L8P_T1_16) C14(IO_L3P_T0_DQS_16) C15(IO_L3N_T0_DQS_16) C17(IO_L12N_T1_MRCC_16) C22(IO_L20P_T3_16) D14(IO_L6P_T0_16) D16(IO_L5N_T0_16) D19(IO_L14N_T2_SRCC_16) D20(IO_L19P_T3_16) D22(IO_L22N_T3_16) E17(IO_L2N_T0_16) E18(IO_L15N_T2_DQS_16) E19(IO_L14P_T2_SRCC_16) E21(IO_L23P_T3_16) E22(IO_L22P_T3_16) F4(IO_0_35) F15(IO_0_16) F18(IO_L15P_T2_DQS_16) F19(IO_L18P_T2_16) F20(IO_L18N_T2_16) F21(IO_25_16) G4(IO_L12N_T1_MRCC_35) G21(IO_L24P_T3_16) G22(IO_L24N_T3_16) J16(IO_0_15) L4(IO_L18N_T2_35) L6(IO_25_35) M17(IO_25_15) N13(IO_L23P_T3_A03_D19_14) N14(IO_L23N_T3_A02_D18_14) N15(IO_25_14) N17(IO_L21P_T3_DQS_14) P14(IO_L19P_T3_A10_D26_14) P15(IO_L22P_T3_A05_D21_14) P16(IO_L24P_T3_A01_D17_14) P17(IO_L21N_T3_DQS_A06_D22_14) P19(IO_L5P_T0_D06_14) P20(IO_0_14) R4(IO_L13P_T2_MRCC_34) R6(IO_L17P_T2_34) R14(IO_L19N_T3_A09_D25_VREF_14) R16(IO_L22N_T3_A04_D20_14) R17(IO_L24N_T3_A00_D16_14) R18(IO_L20P_T3_A08_D24_14) R19(IO_L5N_T0_D07_14) T1(IO_L1P_T0_34) T3(IO_0_34) T4(IO_L13N_T2_MRCC_34) T5(IO_L14P_T2_SRCC_34) T6(IO_L17N_T2_34) T18(IO_L20N_T3_A07_D23_14) T20(IO_L6N_T0_D08_VREF_14) T21(IO_L4P_T0_D04_14) U1(IO_L1N_T0_34) U2(IO_L2P_T0_34) U3(IO_L6P_T0_34) U7(IO_25_34) U18(IO_L18N_T2_A11_D27_14) V18(IO_L14P_T2_SRCC_14) W1(IO_L5P_T0_34) W2(IO_L4P_T0_34) W20(IO_L12N_T1_MRCC_14) Y4(IO_L11P_T1_SRCC_34) Y6(IO_L18P_T2_34)

### Layout directives
differential pair: DDR3_CK_N, DDR3_CK_P, DDR3_DQS0_N, DDR3_DQS0_P, DDR3_DQS1_N, DDR3_DQS1_P, DDR3_DQS2_N, DDR3_DQS2_P, DDR3_DQS3_N, DDR3_DQS3_P, MGT_Rx0_N, MGT_Rx0_P, MGT_Rx1_N, MGT_Rx1_P, MGT_Rx2_N, MGT_Rx2_P, MGT_Rx3_N, MGT_Rx3_P, MGT_Tx0_N, MGT_Tx0_P, MGT_Tx1_N, MGT_Tx1_P, MGT_Tx2_N, MGT_Tx2_P, MGT_Tx3_N, MGT_Tx3_P, MGT_TxC0_N, MGT_TxC0_P, MGT_TxC1_N, MGT_TxC1_P, MGT_TxC2_N, MGT_TxC2_P, MGT_TxC3_N, MGT_TxC3_P, REF_CLKC_N, REF_CLKC_P, REFCLK_N, REFCLK_P, USR_LVDS1_N, USR_LVDS1_P, USR_LVDS2_N, USR_LVDS2_P, USR_LVDS3_N, USR_LVDS3_P, USR_LVDS4_N, USR_LVDS4_P, USR_LVDS5_N, USR_LVDS5_P, USR_LVDS6_N, USR_LVDS6_P, USR_LVDS7_N, USR_LVDS7_P, USR_LVDS8_N, USR_LVDS8_P, USR_LVDS9_N, USR_LVDS9_P, USR_LVDS10_N, USR_LVDS10_P, USR_LVDS11CC_N, USR_LVDS11CC_P, USR_LVDS12CC_N, USR_LVDS12CC_P, USR_LVDS13CC_N, USR_LVDS13CC_P, USR_LVDS14CC_N, USR_LVDS14CC_P, USR_LVDS15_N, USR_LVDS15_P, USR_LVDS16_N, USR_LVDS16_P, USR_LVDS17_N, USR_LVDS17_P, USR_LVDS18_N, USR_LVDS18_P, USR_LVDS19_N, USR_LVDS19_P, USR_LVDS20_N, USR_LVDS20_P, USR_LVDS21_N, USR_LVDS21_P, USR_LVDS22_N, USR_LVDS22_P, USR_LVDS23_N, USR_LVDS23_P, USR_LVDS24_N, USR_LVDS24_P
net class Z100R: MGT_Rx0_N, MGT_Rx0_P, MGT_Rx1_N, MGT_Rx1_P, MGT_Rx2_N, MGT_Rx2_P, MGT_Rx3_N, MGT_Rx3_P, MGT_Tx0_N, MGT_Tx0_P, MGT_Tx1_N, MGT_Tx1_P, MGT_Tx2_N, MGT_Tx2_P, MGT_Tx3_N, MGT_Tx3_P, MGT_TxC0_N, MGT_TxC0_P, MGT_TxC1_N, MGT_TxC1_P, MGT_TxC2_N, MGT_TxC2_P, MGT_TxC3_N, MGT_TxC3_P, REF_CLKC_N, REF_CLKC_P, REFCLK_N, REFCLK_P, USR_LVDS1_N, USR_LVDS1_P, USR_LVDS2_N, USR_LVDS2_P, USR_LVDS3_N, USR_LVDS3_P, USR_LVDS4_N, USR_LVDS4_P, USR_LVDS5_N, USR_LVDS5_P, USR_LVDS6_N, USR_LVDS6_P, USR_LVDS7_N, USR_LVDS7_P, USR_LVDS8_N, USR_LVDS8_P, USR_LVDS9_N, USR_LVDS9_P, USR_LVDS10_N, USR_LVDS10_P, USR_LVDS11CC_N, USR_LVDS11CC_P, USR_LVDS12CC_N, USR_LVDS12CC_P, USR_LVDS13CC_N, USR_LVDS13CC_P, USR_LVDS14CC_N, USR_LVDS14CC_P, USR_LVDS15_N, USR_LVDS15_P, USR_LVDS16_N, USR_LVDS16_P, USR_LVDS17_N, USR_LVDS17_P, USR_LVDS18_N, USR_LVDS18_P, USR_LVDS19_N, USR_LVDS19_P, USR_LVDS20_N, USR_LVDS20_P, USR_LVDS21_N, USR_LVDS21_P, USR_LVDS22_N, USR_LVDS22_P, USR_LVDS23_N, USR_LVDS23_P, USR_LVDS24_N, USR_LVDS24_P

### Notes on the sheet
- DDR3
- TX side
- This design is derived from NETV2 project
  https://github.com/AlphamaxMedia/netv2-mainboard
  Parts of schematics and routing were used.
- Project/Equipment
- Document
- Designer
- Drawn by
- Check.by
- Copyright WUT ISE 2019.
  This documentation describes Open Hardware and is licensed under the CERN OHL v.1.1. You may redistribute and modify this documentation under the terms of the CERN OHL v.1.1. (http://ohwr.org/CERNOHL). This documentation is distributed WITHOUT ANY EXPRESS OR IMPLIED WARRANTY, INCLUDING OF MERCHANTABILITY, SATISFACTORY QUALITY AND FITNESS FOR A PARTICULAR PURPOSE. Please see the CERN OHL v.1.1 for applicable conditions.
- Contact
- File
- Last Mod.
- Print Date
- Sheet
- Size
- A3
- of
- Rev
- (in symbol R0402_1K_1%_0.0625W_100PPM) 1%
- (in symbol R0402_100R_1%_0.1W_100PPM) 1%
- (in symbol XC7A50T-2FGG484C, part A) BANK 14
- (in symbol XC7A50T-2FGG484C, part B) BANK 15
- (in symbol XC7A50T-2FGG484C, part C) BANK 16
- (in symbol XC7A50T-2FGG484C, part D) BANK 34
- (in symbol XC7A50T-2FGG484C, part E) BANK 35

### Library data of the parts
B14 B15 B18-B21 = SMD_PAD_D1MM: Through Hole Pad; Part Description: 1mm Diameter SMD Pad; Mounted: No; Part Number: SMD_PAD_D1MM; Component Kind: Standard (No BOM); Component Type: Standard (No BOM); Pin Count: 1; Family: SMD Pad; Socket: No; SMD: No; Sense: No; Status: None; ComponentHeight: 0mm; HelpURL: Undefined; Author: CERN DEM JLC; CreateDate: 10.10.2017; LatestRevisionDate: 10.10.2017; PackageDescription: 1mm Diameter SMD Pad
C48-C51 = CC0201_470NF_4V_20%_X5R: Non-polarised capacitor; Part Description: SMD Multilayer Chip Ceramic Capacitor; Manufacturer: GENERIC; Manufacturer1 Part Number: AMK063BJ474MP-F; Voltage: 4V; TC: X5R; Tolerance: ±20%; Part Number: CC0201_470NF_4V_20%_X5R; Component Kind: Standard; Component Type: Standard; Pin Count: 2; Value: 470nF; Status: Not Recommended; Manufacturer Part Number: CC0201_470NF_4V_20%_X5R; Case: 0201; Mounted: Yes; Socket: No; SMD: Yes; Sense: No; Manufacturer1 Example: TAIYO YUDEN; Manufacturer1 ComponentHeight: 0.33mm; HelpURL: \\cern.ch\dfs\Applications\Altium\Datasheets\CC0201_X5R_TAIYO-YUDEN_STANDARD-CLASS2.pdf; Author: CERN DEM JLC; CreateDate: 27.05.2010; LatestRevisionDate: 27.05.2010
C52-C62 = CC0201_100NF_6.3V_10%_X5R: as C45 on sheet FPGA_config; Part Number: CC0201_100NF_6.3V_10%_X5R; Component Kind: Standard; Component Type: Standard; Pin Count: 2; Value: 100nF; Status: Not Recommended; Manufacturer Part Number: CC0201_100NF_6.3V_10%_X5R; Case: 0201; Mounted: Yes; Socket: No; SMD: Yes; Sense: No; Manufacturer1 Example: AVX; Manufacturer1 ComponentHeight: 0.33mm; HelpURL: \\cern.ch\dfs\Applications\Altium\Datasheets\CC0201_X5R_AVX.pdf; Author: CERN DEM JLC; CreateDate: 03.12.2007; LatestRevisionDate: 03.12.2007
IC2 = XC7A50T-2FGG484C: as IC2 on sheet FPGA_config; Part Number: XC7A50T-2FGG484C; Component Kind: Standard; Component Type: Standard; Device: XC7A50T-2FGG484C; PackageDescription: BGA, 1.00mm Pitch, Square; 484 Pin, 22 Columns x 22 Rows, Body 23mm X 23mm X 2.60mm H, IPC Medium Density; Part Description: Artix-7 FPGA, 4 GTPs, 250 User I/Os, 484-Ball Fine-Pitch Thin BGA (1.0mm Pitch), Speed Grade 2, Commercial Grade, Pb-Free; Manufacturer Part Number: XC7A50T-2FGG484C; Pin Count: 484; Case: BGA484; Mounted: Yes; Socket: No; SMD: Yes; Sense: No; ComponentHeight: 2.6mm; HelpURL: \\cern.ch\dfs\Applications\Altium\Datasheets\XC7A50T-2FGG484C.pdf; ComponentLink1URL: \\cern.ch\dfs\Applications\Altium\Datasheets\XC7A50T-2FGG484C_Package-Pinout.pdf; ComponentLink1Description: Package/Pinout; Author: CERN DEM JMW; CreateDate: 26.07.2018; LatestRevisionDate: 26.07.2018
OSC10 = OSC_50MHZ_CTS_636L3I050M00000: Oscillator 4 pins 1=OE 2=GND 3=OUT 4=VCC; Part Description: 3.3V, ±50ppm, 30pF, -40..85°C, HCMOS/TTL Clock Oscillator, 636 Series; Manufacturer: CTS ELECTRONIC COMPONENTS; PressFit: No; Bonding: No; Part Number: OSC_50MHZ_CTS_636L3I050M00000; Component Kind: Standard; Component Type: Standard; PackageDescription: Oscillator, Side Concave; 2.54mm Pitch; 4 pin, 3.20mm L X 5.00mm W X 1.30mm H, IPC Medium Density; Value: 50MHz; Manufacturer Part Number: 636L3I050M00000; Pin Count: 4; Mounted: Yes; Socket: No; SMD: Yes; Sense: No; ComponentHeight: 1.3mm; HelpURL: \\cern.ch\dfs\Applications\Altium\Datasheets\OSC_CTS_636.pdf; Author: CERN DEM JMW; CreateDate: 22.09.2015; LatestRevisionDate: 22.09.2015
R52 = R0402_1K_1%_0.0625W_100PPM: as R48 on sheet FPGA_config; Part Number: R0402_1K_1%_0.0625W_100PPM; Component Kind: Standard; Component Type: Standard; Pin Count: 2; Value: 1k; Status: Not Recommended; Power: 0.0625W; Tolerance: ±1%; Manufacturer Part Number: R0402_1K_1%_0.0625W_100PPM; Case: 0402; Mounted: Yes; Sense: No; Socket: No; SMD: Yes; Manufacturer1 Example: YAGEO PHYCOMP; Manufacturer1 ComponentHeight: 0.4mm; HelpURL: \\cern.ch\dfs\Applications\Altium\Datasheets\R0402_Phycomp_RC0402.pdf; Author: CERN DEM JLC; CreateDate: 03.12.2007; LatestRevisionDate: 17.10.2012
R53 = R0402_100R_1%_0.1W_100PPM: Resistor - 1%; Part Description: General Purpose Thick Film Chip Resistor; Manufacturer: GENERIC; Manufacturer Part Number: R0402_100R_1%_0.1W_100PPM_50V; Manufacturer1 Part Number: ERJ2RKF1000X; Power: 0.1W; TC: ±100ppm/°C; Voltage: 50V; PressFit: No; Part Number: R0402_100R_1%_0.1W_100PPM; Component Kind: Standard; Component Type: Standard; Pin Count: 2; Value: 100; Status: Not Recommended; Tolerance: ±1%; Case: 0402; Mounted: Yes; Sense: No; Socket: No; SMD: Yes; Manufacturer1 Example: PANASONIC; Manufacturer1 ComponentHeight: 0.4mm; HelpURL: \\cern.ch\dfs\Applications\Altium\Datasheets\R0402_PANASONIC_ERJ2RK.pdf; Author: CERN DEM JLC; CreateDate: 12.12.2013; LatestRevisionDate: 03.03.2015

## Sheet DDR3_Memory.SchDoc: RNG RPI Interface
size 420 x 297 mm; Author: G.Kasprowicz; CompanyName: WUT ISE; DrawnBy: G.Kasprowicz; Organization: WUT ISE; Address1: PW ISE; Address2: Nowowiejska 15/19 00-665 Warsaw; Address3: gkasprow@gmail.com; Revision: 2; SheetNumber: -; SheetTotal: -; ModifiedBy: -; CheckedDate: -; Title2: DDR3 memory; DivGrp: WUT ISE; Designer: G.Kasprowicz; ModifiedDate: -; ProjectName: Sensor Box
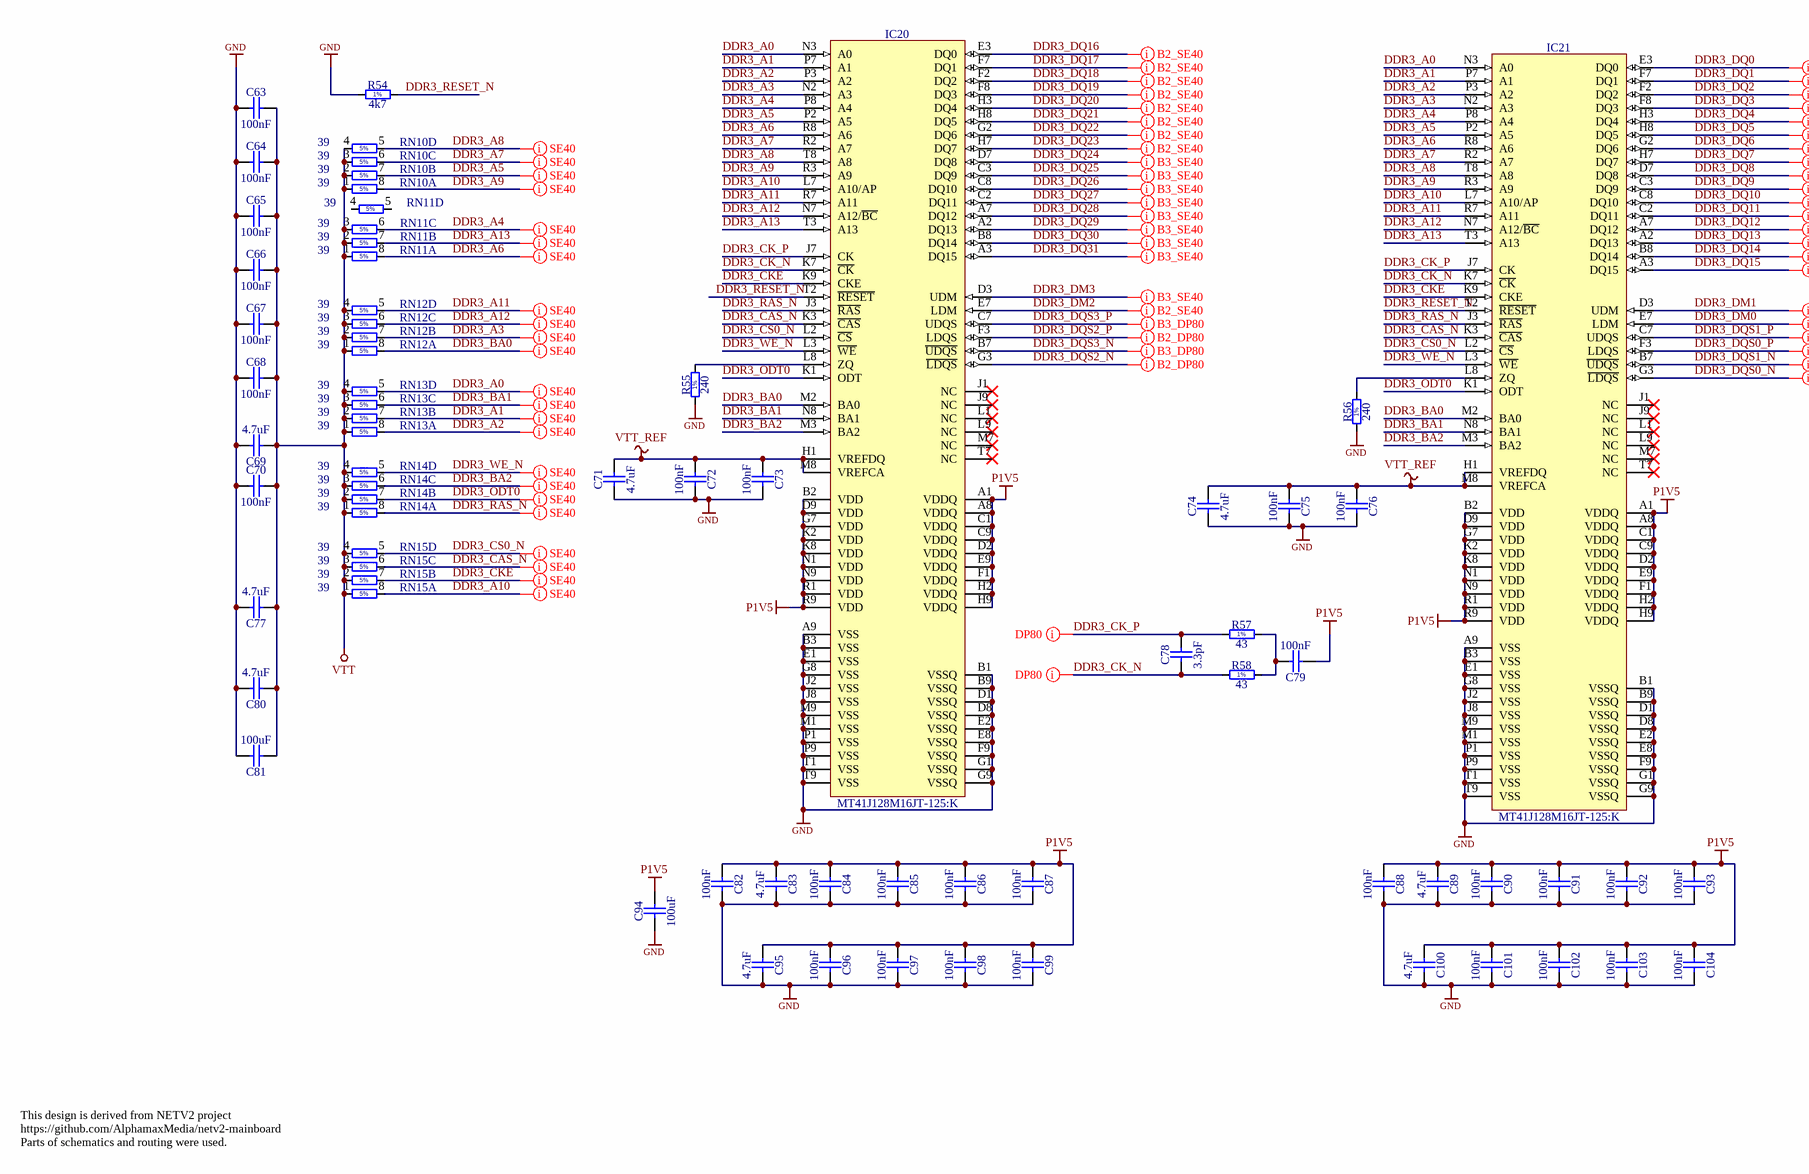
[diagram p3: DDR3_Memory.SchDoc]

### Parts
C63  100nF  [CAPC0603X33N]
C64  100nF  [CAPC0603X33N]
C65  100nF  [CAPC0603X33N]
C66  100nF  [CAPC0603X33N]
C67  100nF  [CAPC0603X33N]
C68  100nF  [CAPC0603X33N]
C69  4.7uF  [CAPC1005X55N]
C70  100nF  [CAPC0603X33N]
C71  4.7uF  [CAPC1005X55N]
C72  100nF  [CAPC0603X33N]
C73  100nF  [CAPC0603X33N]
C74  4.7uF  [CAPC1005X55N]
C75  100nF  [CAPC0603X33N]
C76  100nF  [CAPC0603X33N]
C77  4.7uF  [CAPC1005X55N]
C78  3.3pF  [CAPC1005X55N]
C79  100nF  [CAPC0603X33N]
C80  4.7uF  [CAPC1005X55N]
C81  100uF  [CAPC3216X180N]
C82  100nF  [CAPC0603X33N]
C83  4.7uF  [CAPC1005X55N]
C84  100nF  [CAPC0603X33N]
C85  100nF  [CAPC0603X33N]
C86  100nF  [CAPC0603X33N]
C87  100nF  [CAPC0603X33N]
C88  100nF  [CAPC0603X33N]
C89  4.7uF  [CAPC1005X55N]
C90  100nF  [CAPC0603X33N]
C91  100nF  [CAPC0603X33N]
C92  100nF  [CAPC0603X33N]
C93  100nF  [CAPC0603X33N]
C94  100uF  [CAPC3216X180N]
C95  4.7uF  [CAPC1005X55N]
C96  100nF  [CAPC0603X33N]
C97  100nF  [CAPC0603X33N]
C98  100nF  [CAPC0603X33N]
C99  100nF  [CAPC0603X33N]
C100  4.7uF  [CAPC1005X55N]
C101  100nF  [CAPC0603X33N]
C102  100nF  [CAPC0603X33N]
C103  100nF  [CAPC0603X33N]
C104  100nF  [CAPC0603X33N]
IC20  MT41J128M16JT-125:K  [BGA96C80P9X16_900X1400X120]
IC21  MT41J128M16JT-125:K  [BGA96C80P9X16_900X1400X120]
R54  4k7  [RESC1005X40N]
R55  240  [RESC1005X40N]
R56  240  [RESC1005X40N]
R57  43  [RESC1005X40N]
R58  43  [RESC1005X40N]
RN10  39  [RN_YAGEO_YC124]  (parts A,B,C,D of 4)
RN11  39  [RN_YAGEO_YC124]  (parts A,B,C,D of 4)
RN12  39  [RN_YAGEO_YC124]  (parts A,B,C,D of 4)
RN13  39  [RN_YAGEO_YC124]  (parts A,B,C,D of 4)
RN14  39  [RN_YAGEO_YC124]  (parts A,B,C,D of 4)
RN15  39  [RN_YAGEO_YC124]  (parts A,B,C,D of 4)

### Nets
GND: C63.1 C64.1 C65.1 C66.1 C67.1 C68.1 C69.2 C70.1 C71.1 C72.2 C73.2 C74.1 C75.2 C76.2 C77.2 C80.2 C81.2 C82.2 C83.2 C84.2 C85.2 C86.2 C87.2 C88.2 C89.2 C90.2 C91.2 C92.2 C93.2 C94.1 C95.2 C96.2 C97.2 C98.2 C99.2 C100.2 C101.2 C102.2 C103.2 C104.2 IC20.A9(VSS) IC20.B1(VSSQ) IC20.B3(VSS) IC20.B9(VSSQ) IC20.D1(VSSQ) IC20.D8(VSSQ) IC20.E1(VSS) IC20.E2(VSSQ) IC20.E8(VSSQ) IC20.F9(VSSQ) IC20.G1(VSSQ) IC20.G8(VSS) IC20.G9(VSSQ) IC20.J2(VSS) IC20.J8(VSS) IC20.M1(VSS) IC20.M9(VSS) IC20.P1(VSS) IC20.P9(VSS) IC20.T1(VSS) IC20.T9(VSS) IC21.A9(VSS) IC21.B1(VSSQ) IC21.B3(VSS) IC21.B9(VSSQ) IC21.D1(VSSQ) IC21.D8(VSSQ) IC21.E1(VSS) IC21.E2(VSSQ) IC21.E8(VSSQ) IC21.F9(VSSQ) IC21.G1(VSSQ) IC21.G8(VSS) IC21.G9(VSSQ) IC21.J2(VSS) IC21.J8(VSS) IC21.M1(VSS) IC21.M9(VSS) IC21.P1(VSS) IC21.P9(VSS) IC21.T1(VSS) IC21.T9(VSS) R54.1 R55.1 R56.1
P1V5: C79.1 C82.1 C83.1 C84.1 C85.1 C86.1 C87.1 C88.1 C89.1 C90.1 C91.1 C92.1 C93.1 C94.2 C95.1 C96.1 C97.1 C98.1 C99.1 C100.1 C101.1 C102.1 C103.1 C104.1 IC20.A1(VDDQ) IC20.A8(VDDQ) IC20.B2(VDD) IC20.C1(VDDQ) IC20.C9(VDDQ) IC20.D2(VDDQ) IC20.D9(VDD) IC20.E9(VDDQ) IC20.F1(VDDQ) IC20.G7(VDD) IC20.H2(VDDQ) IC20.H9(VDDQ) IC20.K2(VDD) IC20.K8(VDD) IC20.N1(VDD) IC20.N9(VDD) IC20.R1(VDD) IC20.R9(VDD) IC21.A1(VDDQ) IC21.A8(VDDQ) IC21.B2(VDD) IC21.C1(VDDQ) IC21.C9(VDDQ) IC21.D2(VDDQ) IC21.D9(VDD) IC21.E9(VDDQ) IC21.F1(VDDQ) IC21.G7(VDD) IC21.H2(VDDQ) IC21.H9(VDDQ) IC21.K2(VDD) IC21.K8(VDD) IC21.N1(VDD) IC21.N9(VDD) IC21.R1(VDD) IC21.R9(VDD)
VTT: C63.2 C64.2 C65.2 C66.2 C67.2 C68.2 C69.1 C70.2 C77.1 C80.1 C81.1 RN10.1 RN10.2 RN10.3 RN10.4 RN11.1 RN11.2 RN11.3 RN12.1 RN12.2 RN12.3 RN12.4 RN13.1 RN13.2 RN13.3 RN13.4 RN14.1 RN14.2 RN14.3 RN14.4 RN15.1 RN15.2 RN15.3 RN15.4
VTT_REF: C71.2 C72.1 C73.1 C74.2 C75.1 C76.1 IC20.H1(VREFDQ) IC20.M8(VREFCA) IC21.H1(VREFDQ) IC21.M8(VREFCA)
DDR3_A0: IC20.N3(A0) IC21.N3(A0) RN13.5
DDR3_A1: IC20.P7(A1) IC21.P7(A1) RN13.7
DDR3_A2: IC20.P3(A2) IC21.P3(A2) RN13.8
DDR3_A3: IC20.N2(A3) IC21.N2(A3) RN12.7
DDR3_A4: IC20.P8(A4) IC21.P8(A4) RN11.6
DDR3_A5: IC20.P2(A5) IC21.P2(A5) RN10.7
DDR3_A6: IC20.R8(A6) IC21.R8(A6) RN11.8
DDR3_A7: IC20.R2(A7) IC21.R2(A7) RN10.6
DDR3_A8: IC20.T8(A8) IC21.T8(A8) RN10.5
DDR3_A9: IC20.R3(A9) IC21.R3(A9) RN10.8
DDR3_A10: IC20.L7(A10/AP) IC21.L7(A10/AP) RN15.8
DDR3_A11: IC20.R7(A11) IC21.R7(A11) RN12.5
DDR3_A12: IC20.N7(A12/~{BC}) IC21.N7(A12/~{BC}) RN12.6
DDR3_A13: IC20.T3(A13) IC21.T3(A13) RN11.7
DDR3_BA0: IC20.M2(BA0) IC21.M2(BA0) RN12.8
DDR3_BA1: IC20.N8(BA1) IC21.N8(BA1) RN13.6
DDR3_BA2: IC20.M3(BA2) IC21.M3(BA2) RN14.6
DDR3_CAS_N: IC20.K3(~{CAS}) IC21.K3(~{CAS}) RN15.6
DDR3_CK_N: C78.1 IC20.K7(~{CK}) IC21.K7(~{CK}) R58.1
DDR3_CK_P: C78.2 IC20.J7(CK) IC21.J7(CK) R57.1
DDR3_CKE: IC20.K9(CKE) IC21.K9(CKE) RN15.7
DDR3_CS0_N: IC20.L2(~{CS}) IC21.L2(~{CS}) RN15.5
DDR3_DM0: IC21.E7(LDM)
DDR3_DM1: IC21.D3(UDM)
DDR3_DM2: IC20.E7(LDM)
DDR3_DM3: IC20.D3(UDM)
DDR3_DQ0: IC21.E3(DQ0)
DDR3_DQ1: IC21.F7(DQ1)
DDR3_DQ2: IC21.F2(DQ2)
DDR3_DQ3: IC21.F8(DQ3)
DDR3_DQ4: IC21.H3(DQ4)
DDR3_DQ5: IC21.H8(DQ5)
DDR3_DQ6: IC21.G2(DQ6)
DDR3_DQ7: IC21.H7(DQ7)
DDR3_DQ8: IC21.D7(DQ8)
DDR3_DQ9: IC21.C3(DQ9)
DDR3_DQ10: IC21.C8(DQ10)
DDR3_DQ11: IC21.C2(DQ11)
DDR3_DQ12: IC21.A7(DQ12)
DDR3_DQ13: IC21.A2(DQ13)
DDR3_DQ14: IC21.B8(DQ14)
DDR3_DQ15: IC21.A3(DQ15)
DDR3_DQ16: IC20.E3(DQ0)
DDR3_DQ17: IC20.F7(DQ1)
DDR3_DQ18: IC20.F2(DQ2)
DDR3_DQ19: IC20.F8(DQ3)
DDR3_DQ20: IC20.H3(DQ4)
DDR3_DQ21: IC20.H8(DQ5)
DDR3_DQ22: IC20.G2(DQ6)
DDR3_DQ23: IC20.H7(DQ7)
DDR3_DQ24: IC20.D7(DQ8)
DDR3_DQ25: IC20.C3(DQ9)
DDR3_DQ26: IC20.C8(DQ10)
DDR3_DQ27: IC20.C2(DQ11)
DDR3_DQ28: IC20.A7(DQ12)
DDR3_DQ29: IC20.A2(DQ13)
DDR3_DQ30: IC20.B8(DQ14)
DDR3_DQ31: IC20.A3(DQ15)
DDR3_DQS0_N: IC21.G3(~{LDQS})
DDR3_DQS0_P: IC21.F3(LDQS)
DDR3_DQS1_N: IC21.B7(~{UDQS})
DDR3_DQS1_P: IC21.C7(UDQS)
DDR3_DQS2_N: IC20.G3(~{LDQS})
DDR3_DQS2_P: IC20.F3(LDQS)
DDR3_DQS3_N: IC20.B7(~{UDQS})
DDR3_DQS3_P: IC20.C7(UDQS)
DDR3_ODT0: IC20.K1(ODT) IC21.K1(ODT) RN14.7
DDR3_RAS_N: IC20.J3(~{RAS}) IC21.J3(~{RAS}) RN14.8
DDR3_RESET_N: IC20.T2(~{RESET}) IC21.T2(~{RESET}) R54.2
DDR3_WE_N: IC20.L3(~{WE}) IC21.L3(~{WE}) RN14.5
NetC79_2: C79.2 R57.2 R58.2
NetIC20_L8: IC20.L8(ZQ) R55.2
NetIC21_L8: IC21.L8(ZQ) R56.2

Not connected (* = marked no-connect by the designer): IC20 J1(NC)* J9(NC)* L1(NC)* L9(NC)* M7(NC)* T7(NC)*; IC21 J1(NC)* J9(NC)* L1(NC)* L9(NC)* M7(NC)* T7(NC)*; RN11 4 5

### Layout directives
net class DP80: DDR3_CK_N, DDR3_CK_P
net class B2_SE40: DDR3_DM2, DDR3_DQ16, DDR3_DQ17, DDR3_DQ18, DDR3_DQ19, DDR3_DQ20, DDR3_DQ21, DDR3_DQ22, DDR3_DQ23
net class B3_SE40: DDR3_DM3, DDR3_DQ24, DDR3_DQ25, DDR3_DQ26, DDR3_DQ27, DDR3_DQ28, DDR3_DQ29, DDR3_DQ30, DDR3_DQ31
net class B3_DP80: DDR3_DQS3_N, DDR3_DQS3_P
net class B2_DP80: DDR3_DQS2_N, DDR3_DQS2_P
net class B0_SE40: DDR3_DM0, DDR3_DQ0, DDR3_DQ1, DDR3_DQ2, DDR3_DQ3, DDR3_DQ4, DDR3_DQ5, DDR3_DQ6, DDR3_DQ7
net class B1_SE40: DDR3_DM1, DDR3_DQ8, DDR3_DQ9, DDR3_DQ10, DDR3_DQ11, DDR3_DQ12, DDR3_DQ13, DDR3_DQ14, DDR3_DQ15
net class B1_DP80: DDR3_DQS1_N, DDR3_DQS1_P
net class B0_DP80: DDR3_DQS0_N, DDR3_DQS0_P
net class SE40: DDR3_A0, DDR3_A1, DDR3_A2, DDR3_A3, DDR3_A4, DDR3_A5, DDR3_A6, DDR3_A7, DDR3_A8, DDR3_A9, DDR3_A10, DDR3_A11, DDR3_A12, DDR3_A13, DDR3_BA0, DDR3_BA1, DDR3_BA2, DDR3_CAS_N, DDR3_CKE, DDR3_CS0_N, DDR3_ODT0, DDR3_RAS_N, DDR3_WE_N

### Notes on the sheet
- This design is derived from NETV2 project
  https://github.com/AlphamaxMedia/netv2-mainboard
  Parts of schematics and routing were used.
- Project/Equipment
- Document
- Designer
- Drawn by
- Check.by
- Copyright WUT ISE 2019.
  This documentation describes Open Hardware and is licensed under the CERN OHL v.1.1. You may redistribute and modify this documentation under the terms of the CERN OHL v.1.1. (http://ohwr.org/CERNOHL). This documentation is distributed WITHOUT ANY EXPRESS OR IMPLIED WARRANTY, INCLUDING OF MERCHANTABILITY, SATISFACTORY QUALITY AND FITNESS FOR A PARTICULAR PURPOSE. Please see the CERN OHL v.1.1 for applicable conditions.
- Contact
- File
- Last Mod.
- Print Date
- Sheet
- Size
- A3
- of
- Rev
- (in symbol R0402_4K7_1%_0.0625W_100PPM) 1%
- (in symbol R0402_43R_1%_0.0625W_100PPM) 1%
- (in symbol R0402_240R_1%_0.0625W_100PPM) 1%
- (in symbol RES_RN_39R_YAGEO_TC124-JR-0739RL, part A) 5%
- (in symbol RES_RN_39R_YAGEO_TC124-JR-0739RL, part B) 5%
- (in symbol RES_RN_39R_YAGEO_TC124-JR-0739RL, part C) 5%
- (in symbol RES_RN_39R_YAGEO_TC124-JR-0739RL, part D) 5%

### Library data of the parts
C63-C68 C70 C72 C73 C75 C76 C79 C82 C84-C88 C90-C93 C96-C99 C101-C104 = CC0201_100NF_6.3V_10%_X5R: as C45 on sheet FPGA_config; Part Number: CC0201_100NF_6.3V_10%_X5R; Component Kind: Standard; Component Type: Standard; Pin Count: 2; Value: 100nF; Status: Not Recommended; Manufacturer Part Number: CC0201_100NF_6.3V_10%_X5R; Case: 0201; Mounted: Yes; Socket: No; SMD: Yes; Sense: No; Manufacturer1 Example: AVX; Manufacturer1 ComponentHeight: 0.33mm; HelpURL: \\cern.ch\dfs\Applications\Altium\Datasheets\CC0201_X5R_AVX.pdf; Author: CERN DEM JLC; CreateDate: 03.12.2007; LatestRevisionDate: 03.12.2007
C69 C71 C74 C77 C80 C83 C89 C95 C100 = CC0402_4.7UF_6.3V_20%_X5R: Non-polarised capacitor; Part Description: SMD Multilayer Chip Ceramic Capacitor; Manufacturer: GENERIC; Manufacturer1 Part Number: C1005X5R0J475M050BC; Voltage: 6.3V; TC: X5R; Tolerance: ±20%; Part Number: CC0402_4.7UF_6.3V_20%_X5R; Component Kind: Standard; Component Type: Standard; Pin Count: 2; Value: 4.7uF; Status: Preferred; Manufacturer Part Number: CC0402_4.7UF_6.3V_20%_X5R; Case: 0402; Mounted: Yes; Socket: No; SMD: Yes; Sense: No; Manufacturer1 Example: TDK; Manufacturer1 ComponentHeight: 0.65mm; HelpURL: \\cern.ch\dfs\Applications\Altium\Datasheets\CC0402_X5R_TDK_C.pdf; Author: CERN DEM JLC; CreateDate: 03.03.2015; LatestRevisionDate: 03.03.2015
C78 = CC0402_3.3PF_50V_0.25PF_C0G: Non-polarised capacitor; Part Description: SMD Multilayer Chip Ceramic Capacitor; Manufacturer: GENERIC; Manufacturer1 Part Number: C0402C339C5GACTU; Voltage: 50V; TC: C0G/NP0; Tolerance: ±0.25pF; Part Number: CC0402_3.3PF_50V_0.25PF_C0G; Component Kind: Standard; Component Type: Standard; Pin Count: 2; Value: 3.3pF; Status: Preferred; Manufacturer Part Number: CC0402_3.3PF_50V_0.25PF_C0G; Case: 0402; Mounted: Yes; Socket: No; SMD: Yes; Sense: No; Manufacturer1 Example: KEMET; Manufacturer1 ComponentHeight: 0.55mm; HelpURL: \\cern.ch\dfs\Applications\Altium\Datasheets\CC0805_C0G_KEMET_(Commercial Grade).pdf; Author: CERN DEM JLC; CreateDate: 03.12.2007; LatestRevisionDate: 22.04.2015
C81 C94 = CC1206_100UF_6.3V_20%_X5R: Non-polarised capacitor; Part Description: SMD Multilayer Chip Ceramic Capacitor; Manufacturer: GENERIC; Manufacturer1 Part Number: C1206C107M9PACTU; Voltage: 6.3V; TC: X5R; Tolerance: ±10%; Part Number: CC1206_100UF_6.3V_20%_X5R; Component Kind: Standard; Component Type: Standard; Pin Count: 2; Value: 100uF; Status: None; Manufacturer Part Number: CC1206_100UF_6.3V_20%_X5R; Case: 1206; Mounted: Yes; Socket: No; SMD: Yes; Sense: No; Manufacturer1 Example: KEMET; Manufacturer1 ComponentHeight: 1.8mm; HelpURL: \\cern.ch\dfs\Applications\Altium\Datasheets\CC1206_X5R_KEMET.pdf; Author: CERN DEM JLC; CreateDate: 26.09.2012; LatestRevisionDate: 26.09.2012
IC20 IC21 = MT41J128M16HA-15E: 16 Meg x 16 x 8 Banks DDR3 SDRAM; Part Description: +1.5V, 2Gb (16 Meg x 16 x 8 Banks) DDR3 SDRAM; Manufacturer: MICRON TECHNOLOGY; PressFit: No; Bonding: No; Part Number: MT41J128M16JT-125:K; Component Kind: Standard; Component Type: Standard; Device: MT41J128M16JT-125:K; PackageDescription: BGA 0.8mm, Pitch, Square 96 Pin, 9 Columns x 16 Rows, Body 14mm X 9mm X 1.2mm H; Manufacturer Part Number: MT41J128M16JT-125:K; Pin Count: 96; Case: BGA96; Mounted: Yes; Socket: No; SMD: Yes; Sense: No; ComponentHeight: 1.2mm; HelpURL: \\cern.ch\dfs\Applications\Altium\Datasheets\MT41J128M16HA-15E.pdf; Author: CERN DEM JLC; CreateDate: 19.11.2009; LatestRevisionDate: 02.11.2011
R54 = R0402_4K7_1%_0.0625W_100PPM: as R44 on sheet FPGA_config; Part Number: R0402_4K7_1%_0.0625W_100PPM; Component Kind: Standard; Component Type: Standard; Pin Count: 2; Value: 4k7; Status: Not Recommended; Power: 0.0625W; Tolerance: ±1%; Manufacturer Part Number: R0402_4K7_1%_0.0625W_100PPM; Case: 0402; Mounted: Yes; Sense: No; Socket: No; SMD: Yes; Manufacturer1 Example: YAGEO PHYCOMP; Manufacturer1 ComponentHeight: 0.4mm; HelpURL: \\cern.ch\dfs\Applications\Altium\Datasheets\R0402_Phycomp_RC0402.pdf; Author: CERN DEM JLC; CreateDate: 03.12.2007; LatestRevisionDate: 17.10.2012
R55 R56 = R0402_240R_1%_0.0625W_100PPM: Resistor - 1%; Part Description: General Purpose Thick Film Chip Resistor; Manufacturer: GENERIC; Manufacturer1 Part Number: 232270672401L; TC: ±100ppm/°C; PressFit: No; Part Number: R0402_240R_1%_0.0625W_100PPM; Component Kind: Standard; Component Type: Standard; Pin Count: 2; Value: 240; Status: Not Recommended; Power: 0.0625W; Tolerance: ±1%; Manufacturer Part Number: R0402_240R_1%_0.0625W_100PPM; Case: 0402; Mounted: Yes; Sense: No; Socket: No; SMD: Yes; Manufacturer1 Example: YAGEO PHYCOMP; Manufacturer1 ComponentHeight: 0.4mm; HelpURL: \\cern.ch\dfs\Applications\Altium\Datasheets\R0402_Phycomp_RC0402.pdf; Author: CERN DEM JLC; CreateDate: 03.12.2007; LatestRevisionDate: 17.10.2012
R57 R58 = R0402_43R_1%_0.0625W_100PPM: Resistor - 1%; Part Description: General Purpose Thick Film Chip Resistor; Manufacturer: GENERIC; Manufacturer1 Part Number: 232270674309L; TC: ±100ppm/°C; PressFit: No; Part Number: R0402_43R_1%_0.0625W_100PPM; Component Kind: Standard; Component Type: Standard; Pin Count: 2; Value: 43; Status: Not Recommended; Power: 0.0625W; Tolerance: ±1%; Manufacturer Part Number: R0402_43R_1%_0.0625W_100PPM; Case: 0402; Mounted: Yes; Sense: No; Socket: No; SMD: Yes; Manufacturer1 Example: YAGEO PHYCOMP; Manufacturer1 ComponentHeight: 0.4mm; HelpURL: \\cern.ch\dfs\Applications\Altium\Datasheets\R0402_Phycomp_RC0402.pdf; Author: CERN DEM JLC; CreateDate: 03.12.2007; LatestRevisionDate: 17.10.2012
RN10-RN15 = RES_RN_39R_YAGEO_TC124-JR-0739RL: 39R Resistor Network 4 Isolated Resistor 5%; Part Number: RN_10R_YAGEO_TC124-JR-0739RL; Part Description: Chip Resistor Array , 4 Isolated Resistors (Side Convex Type S Terminal), YC124 Series; Manufacturer: YAGEO; Power: 0.062W; TC: ±200ppm/°C; PressFit: No; Component Kind: Standard; Component Type: Standard; Pin Count: 8; Value: 39; Sense: No; Status: Recommended; Tolerance: ±5%; Manufacturer Part Number: TC124-JR-0739RL; Case: 0804; Mounted: Yes; Socket: No; SMD: Yes; ComponentHeight: 0.55mm; HelpURL: \\cern.ch\dfs\Applications\Altium\Datasheets\RN_YAGEO_YC124.pdf; Author: GK; CreateDate: 30.11.2011; LatestRevisionDate: 03.05.2017